# EAGLE schematic dsp_ice_rev2_release (EAGLE 7.6.0)

## Sheet 1 of 7
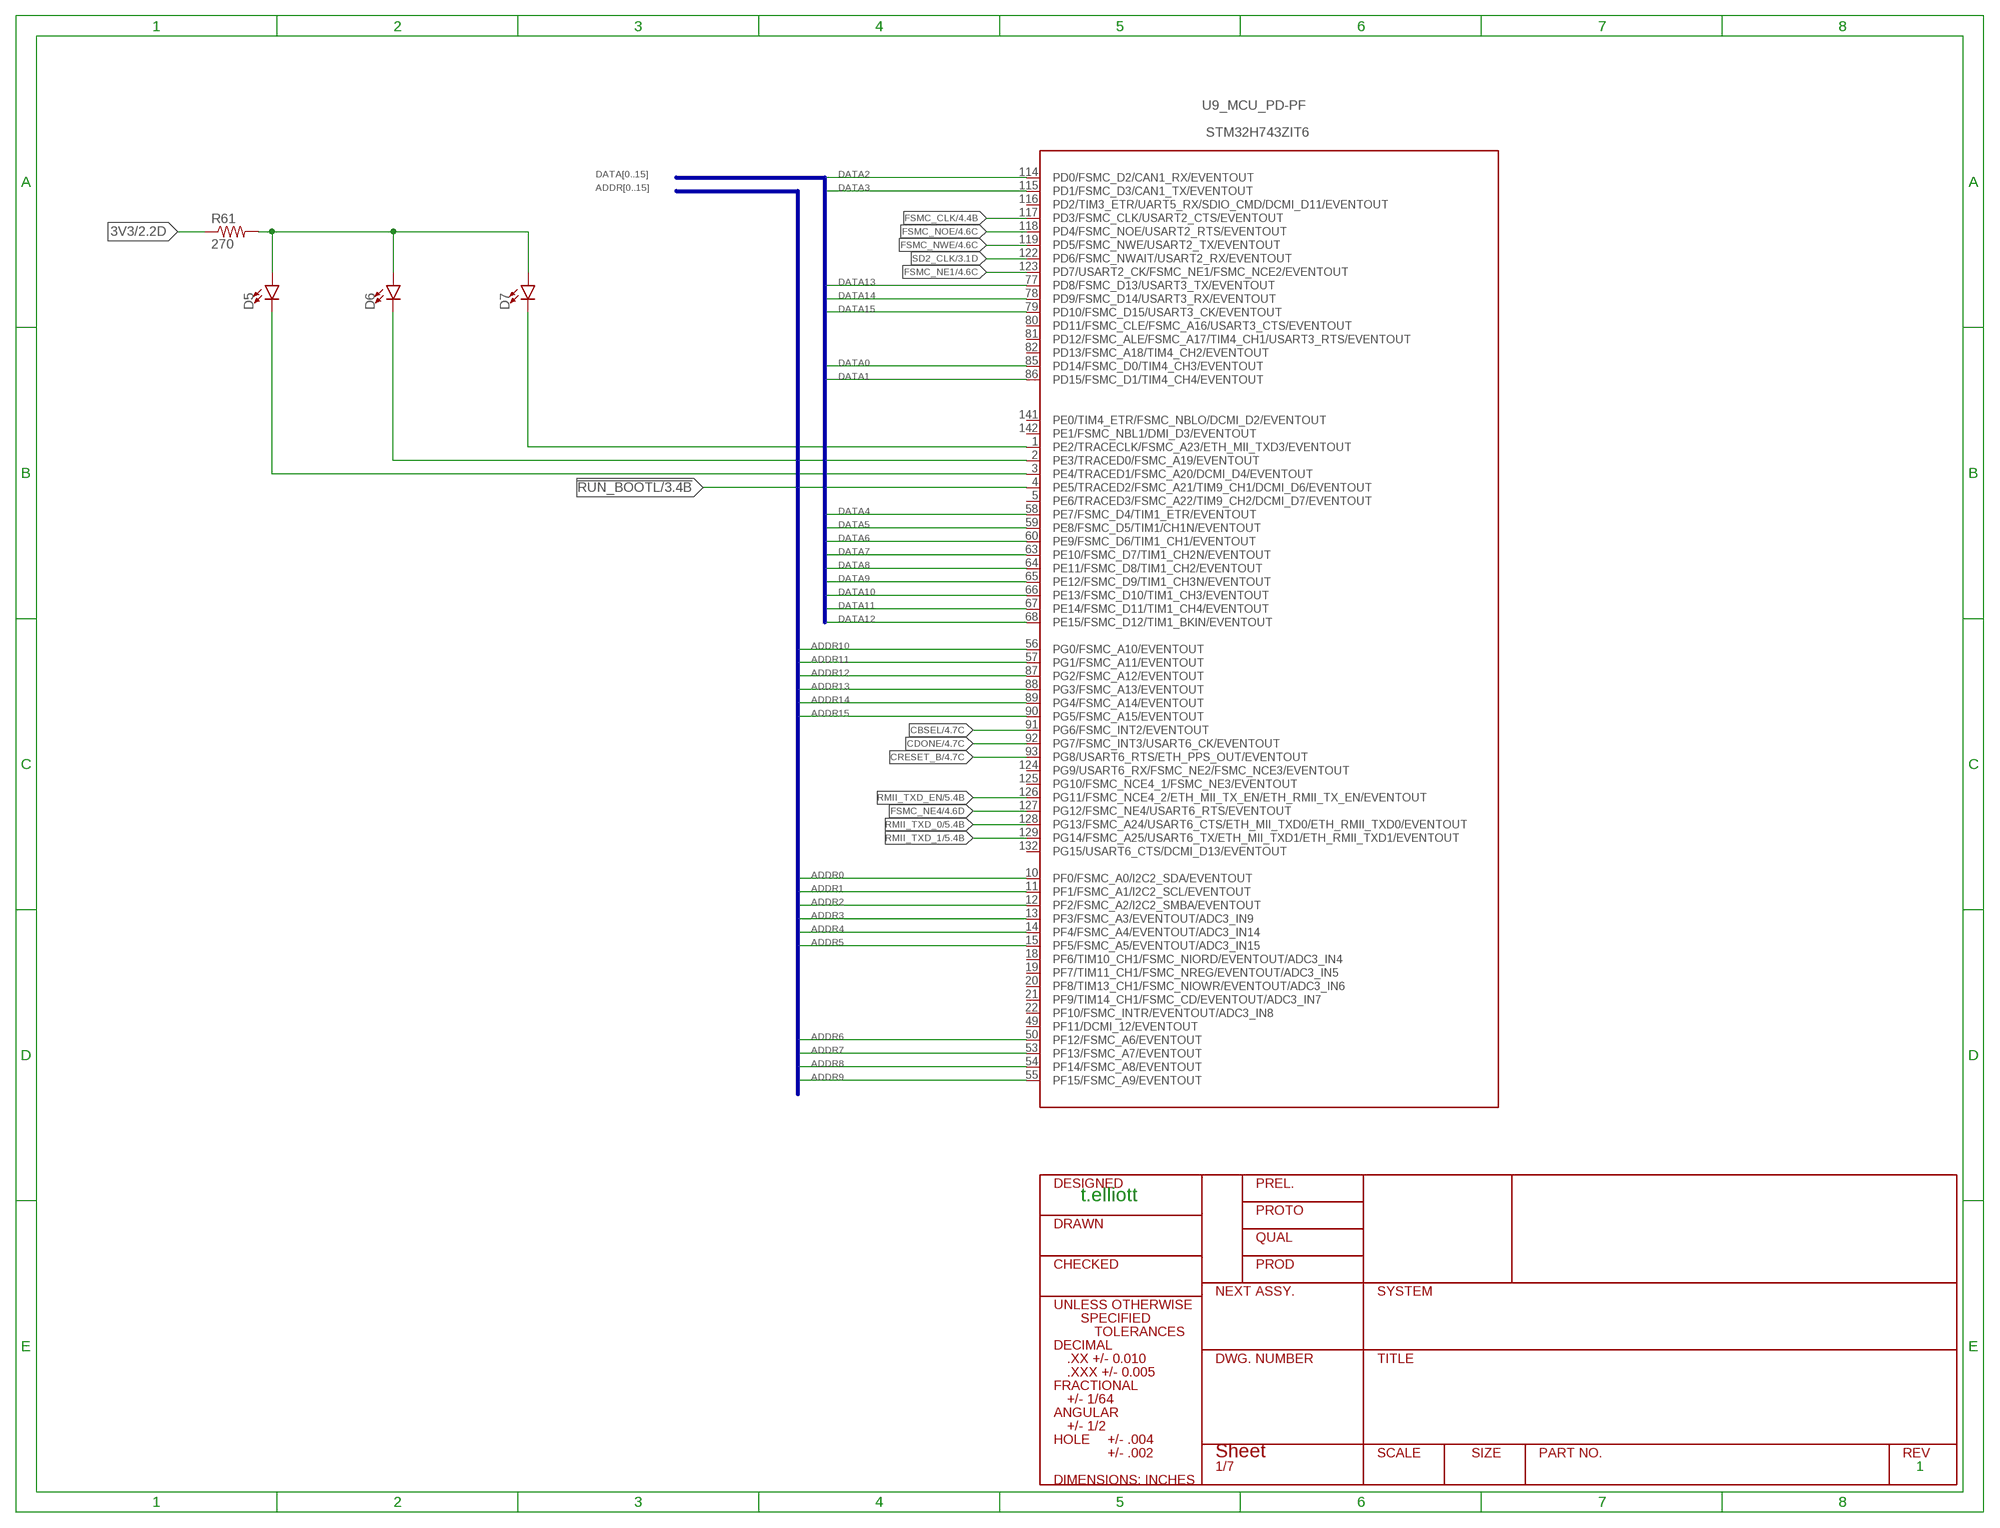
[diagram p0: schematic, sheet 1]

### Parts
D5  LED1206  [LED-1206]
D6  LED1206  [LED-1206]
D7  LED1206  [LED-1206]
R61  270  R-US_R0603  [R0603]
U9  STM32H743ZIT6  STM32F407_144_MG144  [STM32F407_144]

### Nets
3V3: R61.1 ; also sheet 2,3,4,5,6,7
!RUN_BOOTL: U9.4(_MCU_PD-PF:PE5/TRACED2/FSMC_A21/TIM9_CH1/DCMI_D6/EVENTOUT) ; also sheet 3
ADDR0: U9.10(_MCU_PD-PF:PF0/FSMC_A0/I2C2_SDA/EVENTOUT) ; also sheet 4
ADDR1: U9.11(_MCU_PD-PF:PF1/FSMC_A1/I2C2_SCL/EVENTOUT) ; also sheet 4
ADDR2: U9.12(_MCU_PD-PF:PF2/FSMC_A2/I2C2_SMBA/EVENTOUT) ; also sheet 4
ADDR3: U9.13(_MCU_PD-PF:PF3/FSMC_A3/EVENTOUT/ADC3_IN9) ; also sheet 4
ADDR4: U9.14(_MCU_PD-PF:PF4/FSMC_A4/EVENTOUT/ADC3_IN14) ; also sheet 4
ADDR5: U9.15(_MCU_PD-PF:PF5/FSMC_A5/EVENTOUT/ADC3_IN15) ; also sheet 4
ADDR6: U9.50(_MCU_PD-PF:PF12/FSMC_A6/EVENTOUT) ; also sheet 4
ADDR7: U9.53(_MCU_PD-PF:PF13/FSMC_A7/EVENTOUT) ; also sheet 4
ADDR8: U9.54(_MCU_PD-PF:PF14/FSMC_A8/EVENTOUT) ; also sheet 4
ADDR9: U9.55(_MCU_PD-PF:PF15/FSMC_A9/EVENTOUT) ; also sheet 4
ADDR10: U9.56(_MCU_PD-PF:PG0/FSMC_A10/EVENTOUT) ; also sheet 4
ADDR11: U9.57(_MCU_PD-PF:PG1/FSMC_A11/EVENTOUT) ; also sheet 4
ADDR12: U9.87(_MCU_PD-PF:PG2/FSMC_A12/EVENTOUT) ; also sheet 4
ADDR13: U9.88(_MCU_PD-PF:PG3/FSMC_A13/EVENTOUT) ; also sheet 4
ADDR14: U9.89(_MCU_PD-PF:PG4/FSMC_A14/EVENTOUT) ; also sheet 4
ADDR15: U9.90(_MCU_PD-PF:PG5/FSMC_A15/EVENTOUT) ; also sheet 4
CBSEL: U9.91(_MCU_PD-PF:PG6/FSMC_INT2/EVENTOUT) ; also sheet 4
CDONE: U9.92(_MCU_PD-PF:PG7/FSMC_INT3/USART6_CK/EVENTOUT) ; also sheet 4
CRESET_B: U9.93(_MCU_PD-PF:PG8/USART6_RTS/ETH_PPS_OUT/EVENTOUT) ; also sheet 4
DATA0: U9.85(_MCU_PD-PF:PD14/FSMC_D0/TIM4_CH3/EVENTOUT) ; also sheet 4
DATA1: U9.86(_MCU_PD-PF:PD15/FSMC_D1/TIM4_CH4/EVENTOUT) ; also sheet 4
DATA2: U9.114(_MCU_PD-PF:PD0/FSMC_D2/CAN1_RX/EVENTOUT) ; also sheet 4
DATA3: U9.115(_MCU_PD-PF:PD1/FSMC_D3/CAN1_TX/EVENTOUT) ; also sheet 4
DATA4: U9.58(_MCU_PD-PF:PE7/FSMC_D4/TIM1_ETR/EVENTOUT) ; also sheet 4
DATA5: U9.59(_MCU_PD-PF:PE8/FSMC_D5/TIM1/CH1N/EVENTOUT) ; also sheet 4
DATA6: U9.60(_MCU_PD-PF:PE9/FSMC_D6/TIM1_CH1/EVENTOUT) ; also sheet 4
DATA7: U9.63(_MCU_PD-PF:PE10/FSMC_D7/TIM1_CH2N/EVENTOUT) ; also sheet 4
DATA8: U9.64(_MCU_PD-PF:PE11/FSMC_D8/TIM1_CH2/EVENTOUT) ; also sheet 4
DATA9: U9.65(_MCU_PD-PF:PE12/FSMC_D9/TIM1_CH3N/EVENTOUT) ; also sheet 4
DATA10: U9.66(_MCU_PD-PF:PE13/FSMC_D10/TIM1_CH3/EVENTOUT) ; also sheet 4
DATA11: U9.67(_MCU_PD-PF:PE14/FSMC_D11/TIM1_CH4/EVENTOUT) ; also sheet 4
DATA12: U9.68(_MCU_PD-PF:PE15/FSMC_D12/TIM1_BKIN/EVENTOUT) ; also sheet 4
DATA13: U9.77(_MCU_PD-PF:PD8/FSMC_D13/USART3_TX/EVENTOUT) ; also sheet 4
DATA14: U9.78(_MCU_PD-PF:PD9/FSMC_D14/USART3_RX/EVENTOUT) ; also sheet 4
DATA15: U9.79(_MCU_PD-PF:PD10/FSMC_D15/USART3_CK/EVENTOUT) ; also sheet 4
FSMC_CLK: U9.117(_MCU_PD-PF:PD3/FSMC_CLK/USART2_CTS/EVENTOUT) ; also sheet 4
FSMC_NE1: U9.123(_MCU_PD-PF:PD7/USART2_CK/FSMC_NE1/FSMC_NCE2/EVENTOUT) ; also sheet 4
FSMC_NE4: U9.127(_MCU_PD-PF:PG12/FSMC_NE4/USART6_RTS/EVENTOUT) ; also sheet 4
FSMC_NOE: U9.118(_MCU_PD-PF:PD4/FSMC_NOE/USART2_RTS/EVENTOUT) ; also sheet 4
FSMC_NWE: U9.119(_MCU_PD-PF:PD5/FSMC_NWE/USART2_TX/EVENTOUT) ; also sheet 4
N$33: D5.A D6.A D7.A R61.2
N$37: D7.C U9.1(_MCU_PD-PF:PE2/TRACECLK/FSMC_A23/ETH_MII_TXD3/EVENTOUT)
N$38: D6.C U9.2(_MCU_PD-PF:PE3/TRACED0/FSMC_A19/EVENTOUT)
N$43: D5.C U9.3(_MCU_PD-PF:PE4/TRACED1/FSMC_A20/DCMI_D4/EVENTOUT)
RMII_TXD_0: U9.128(_MCU_PD-PF:PG13/FSMC_A24/USART6_CTS/ETH_MII_TXD0/ETH_RMII_TXD0/EVENTOUT) ; also sheet 5
RMII_TXD_1: U9.129(_MCU_PD-PF:PG14/FSMC_A25/USART6_TX/ETH_MII_TXD1/ETH_RMII_TXD1/EVENTOUT) ; also sheet 5
RMII_TXD_EN: U9.126(_MCU_PD-PF:PG11/FSMC_NCE4_2/ETH_MII_TX_EN/ETH_RMII_TX_EN/EVENTOUT) ; also sheet 5
SD2_CLK: U9.122(_MCU_PD-PF:PD6/FSMC_NWAIT/USART2_RX/EVENTOUT) ; also sheet 3
Unconnected: U9.5(_MCU_PD-PF:PE6/TRACED3/FSMC_A22/TIM9_CH2/DCMI_D7/EVENTOUT) U9.18(_MCU_PD-PF:PF6/TIM10_CH1/FSMC_NIORD/EVENTOUT/ADC3_IN4) U9.19(_MCU_PD-PF:PF7/TIM11_CH1/FSMC_NREG/EVENTOUT/ADC3_IN5) U9.20(_MCU_PD-PF:PF8/TIM13_CH1/FSMC_NIOWR/EVENTOUT/ADC3_IN6) U9.21(_MCU_PD-PF:PF9/TIM14_CH1/FSMC_CD/EVENTOUT/ADC3_IN7) U9.22(_MCU_PD-PF:PF10/FSMC_INTR/EVENTOUT/ADC3_IN8) U9.49(_MCU_PD-PF:PF11/DCMI_12/EVENTOUT) U9.80(_MCU_PD-PF:PD11/FSMC_CLE/FSMC_A16/USART3_CTS/EVENTOUT) U9.81(_MCU_PD-PF:PD12/FSMC_ALE/FSMC_A17/TIM4_CH1/USART3_RTS/EVENTOUT) U9.82(_MCU_PD-PF:PD13/FSMC_A18/TIM4_CH2/EVENTOUT) U9.116(_MCU_PD-PF:PD2/TIM3_ETR/UART5_RX/SDIO_CMD/DCMI_D11/EVENTOUT) U9.124(_MCU_PD-PF:PG9/USART6_RX/FSMC_NE2/FSMC_NCE3/EVENTOUT) U9.125(_MCU_PD-PF:PG10/FSMC_NCE4_1/FSMC_NE3/EVENTOUT) U9.132(_MCU_PD-PF:PG15/USART6_CTS/DCMI_D13/EVENTOUT) U9.141(_MCU_PD-PF:PE0/TIM4_ETR/FSMC_NBLO/DCMI_D2/EVENTOUT) U9.142(_MCU_PD-PF:PE1/FSMC_NBL1/DMI_D3/EVENTOUT)

### Buses
DATA[0..15]
ADDR[0..15]

### Notes on the sheet
- t.elliott
- 1

## Sheet 2 of 7
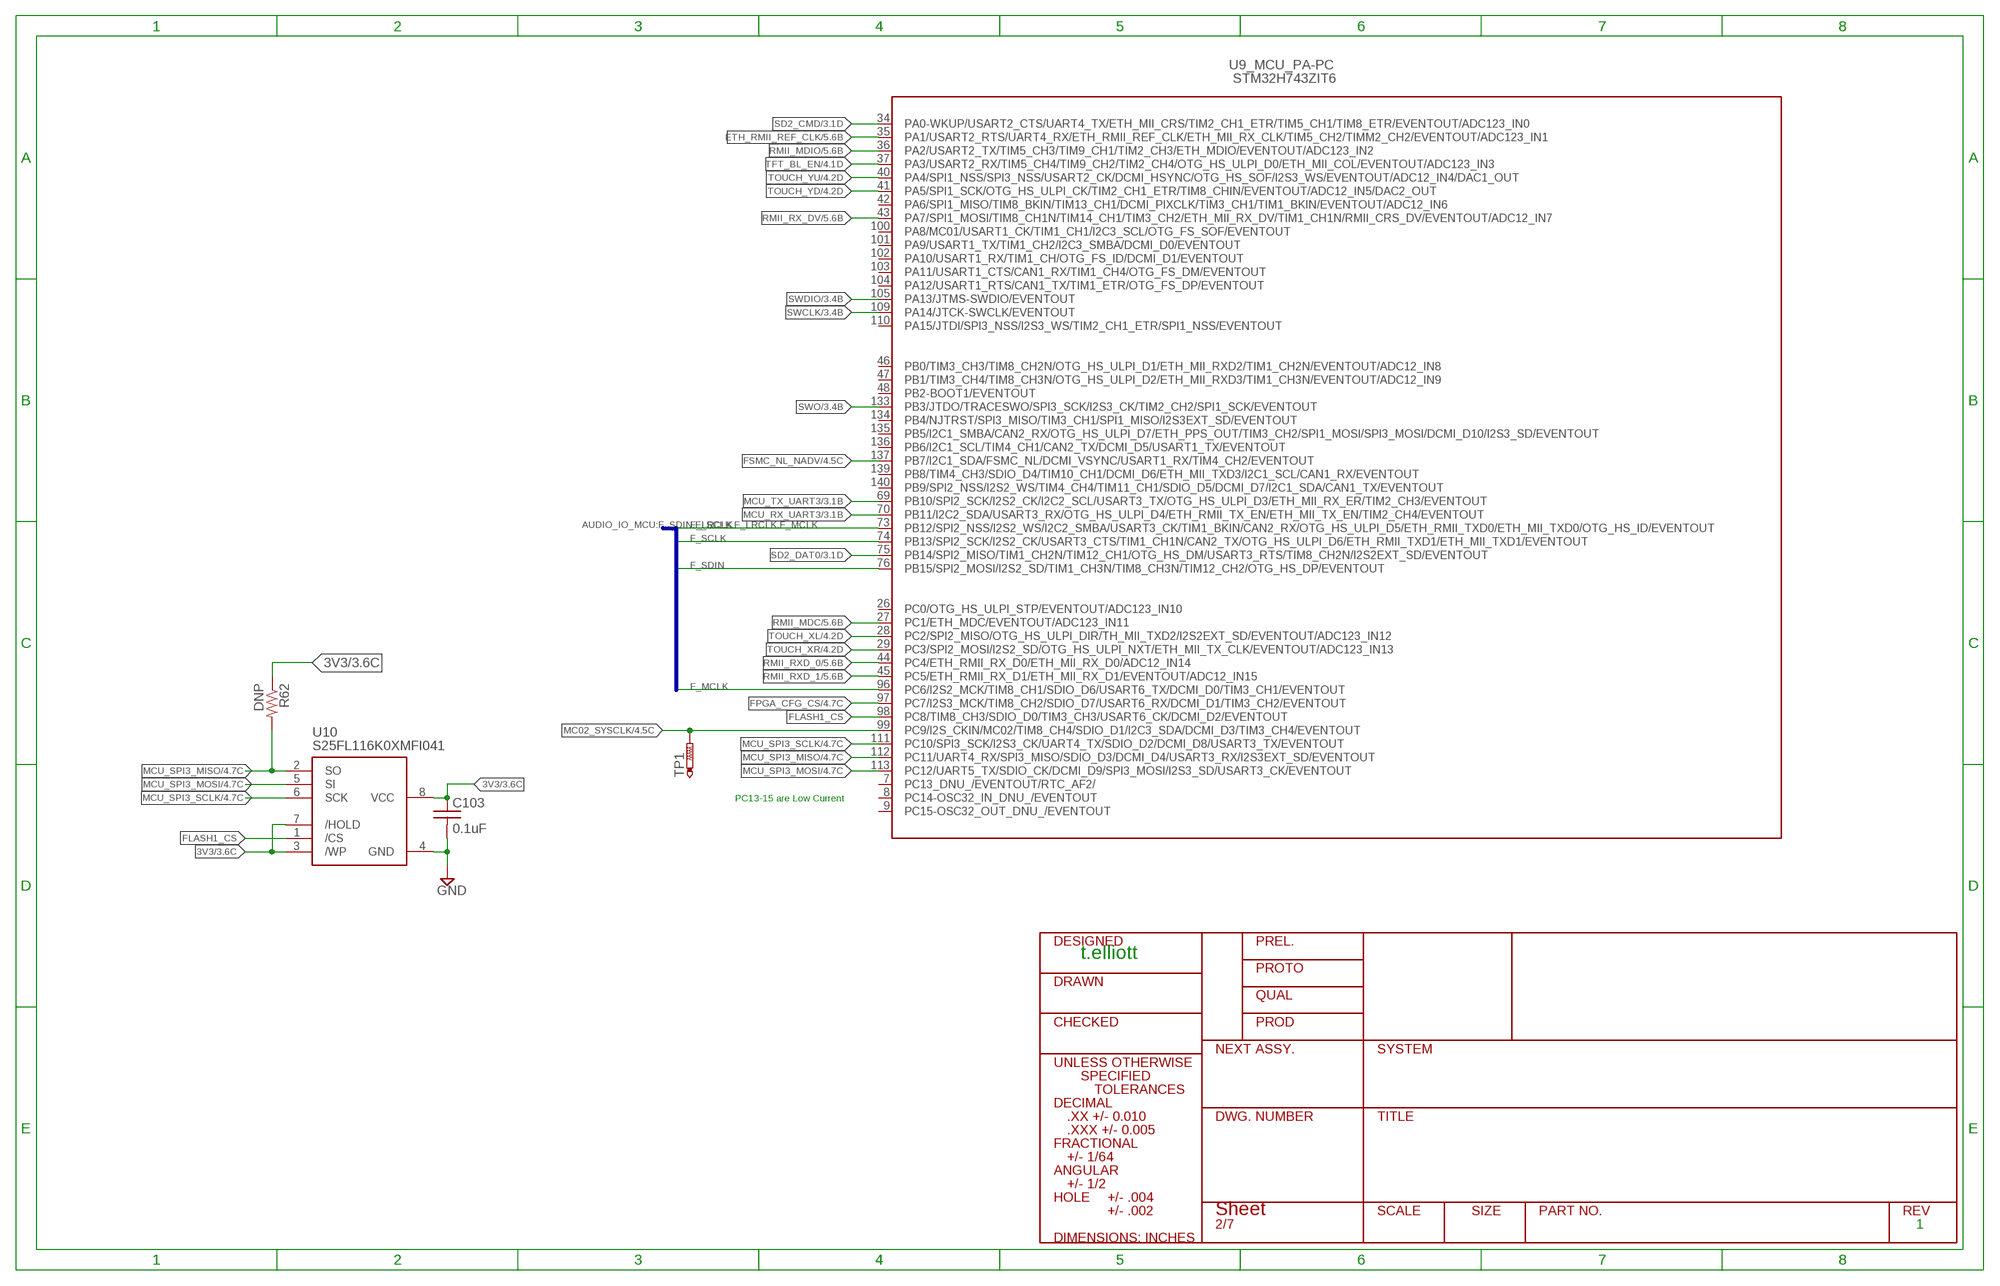
[diagram p1: schematic, sheet 2]

### Parts
C103  0.1uF  C-USC0603  [C0603]
R62  DNP  R-US_R0603  [R0603]
TP1  PTR1TP08R  [TP08R]
U10  S25FL116K0XMFI041  AT25F512ASOIC  [SO8]

### Nets
3V3: C103.1 R62.1 U10.3(/WP) U10.7(/HOLD) U10.8(VCC) ; also sheet 1,3,4,5,6,7
ETH_RMII_REF_CLK: U9.35(_MCU_PA-PC:PA1/USART2_RTS/UART4_RX/ETH_RMII_REF_CLK/ETH_MII_RX_CLK/TIM5_CH2/TIMM2_CH2/EVENTOUT/ADC123_IN1) ; also sheet 5
F_LRCLK: U9.73(_MCU_PA-PC:PB12/SPI2_NSS/I2S2_WS/I2C2_SMBA/USART3_CK/TIM1_BKIN/CAN2_RX/OTG_HS_ULPI_D5/ETH_RMII_TXD0/ETH_MII_TXD0/OTG_HS_ID/EVENTOUT) ; also sheet 4
F_MCLK: U9.96(_MCU_PA-PC:PC6/I2S2_MCK/TIM8_CH1/SDIO_D6/USART6_TX/DCMI_D0/TIM3_CH1/EVENTOUT) ; also sheet 4
F_SCLK: U9.74(_MCU_PA-PC:PB13/SPI2_SCK/I2S2_CK/USART3_CTS/TIM1_CH1N/CAN2_TX/OTG_HS_ULPI_D6/ETH_RMII_TXD1/ETH_MII_TXD1/EVENTOUT) ; also sheet 4
F_SDIN: U9.76(_MCU_PA-PC:PB15/SPI2_MOSI/I2S2_SD/TIM1_CH3N/TIM8_CH3N/TIM12_CH2/OTG_HS_DP/EVENTOUT) ; also sheet 4
FLASH1_CS: U9.98(_MCU_PA-PC:PC8/TIM8_CH3/SDIO_D0/TIM3_CH3/USART6_CK/DCMI_D2/EVENTOUT) U10.1(/CS)
FPGA_CFG_CS: U9.97(_MCU_PA-PC:PC7/I2S3_MCK/TIM8_CH2/SDIO_D7/USART6_RX/DCMI_D1/TIM3_CH2/EVENTOUT) ; also sheet 4
FSMC_NL_NADV: U9.137(_MCU_PA-PC:PB7/I2C1_SDA/FSMC_NL/DCMI_VSYNC/USART1_RX/TIM4_CH2/EVENTOUT) ; also sheet 4
GND: C103.2 U10.4(GND) ; also sheet 3,4,5,6,7
MC02_SYSCLK: TP1.TP U9.99(_MCU_PA-PC:PC9/I2S_CKIN/MC02/TIM8_CH4/SDIO_D1/I2C3_SDA/DCMI_D3/TIM3_CH4/EVENTOUT) ; also sheet 4
MCU_RX_UART3: U9.70(_MCU_PA-PC:PB11/I2C2_SDA/USART3_RX/OTG_HS_ULPI_D4/ETH_RMII_TX_EN/ETH_MII_TX_EN/TIM2_CH4/EVENTOUT) ; also sheet 3
MCU_SPI3_MISO: R62.2 U9.112(_MCU_PA-PC:PC11/UART4_RX/SPI3_MISO/SDIO_D3/DCMI_D4/USART3_RX/I2S3EXT_SD/EVENTOUT) U10.2(SO) ; also sheet 4
MCU_SPI3_MOSI: U9.113(_MCU_PA-PC:PC12/UART5_TX/SDIO_CK/DCMI_D9/SPI3_MOSI/I2S3_SD/USART3_CK/EVENTOUT) U10.5(SI) ; also sheet 4
MCU_SPI3_SCLK: U9.111(_MCU_PA-PC:PC10/SPI3_SCK/I2S3_CK/UART4_TX/SDIO_D2/DCMI_D8/USART3_TX/EVENTOUT) U10.6(SCK) ; also sheet 4
MCU_TX_UART3: U9.69(_MCU_PA-PC:PB10/SPI2_SCK/I2S2_CK/I2C2_SCL/USART3_TX/OTG_HS_ULPI_D3/ETH_MII_RX_ER/TIM2_CH3/EVENTOUT) ; also sheet 3
RMII_MDC: U9.27(_MCU_PA-PC:PC1/ETH_MDC/EVENTOUT/ADC123_IN11) ; also sheet 5
RMII_MDIO: U9.36(_MCU_PA-PC:PA2/USART2_TX/TIM5_CH3/TIM9_CH1/TIM2_CH3/ETH_MDIO/EVENTOUT/ADC123_IN2) ; also sheet 5
RMII_RX_DV: U9.43(_MCU_PA-PC:PA7/SPI1_MOSI/TIM8_CH1N/TIM14_CH1/TIM3_CH2/ETH_MII_RX_DV/TIM1_CH1N/RMII_CRS_DV/EVENTOUT/ADC12_IN7) ; also sheet 5
RMII_RXD_0: U9.44(_MCU_PA-PC:PC4/ETH_RMII_RX_D0/ETH_MII_RX_D0/ADC12_IN14) ; also sheet 5
RMII_RXD_1: U9.45(_MCU_PA-PC:PC5/ETH_RMII_RX_D1/ETH_MII_RX_D1/EVENTOUT/ADC12_IN15) ; also sheet 5
SD2_CMD: U9.34(_MCU_PA-PC:PA0-WKUP/USART2_CTS/UART4_TX/ETH_MII_CRS/TIM2_CH1_ETR/TIM5_CH1/TIM8_ETR/EVENTOUT/ADC123_IN0) ; also sheet 3
SD2_DAT0: U9.75(_MCU_PA-PC:PB14/SPI2_MISO/TIM1_CH2N/TIM12_CH1/OTG_HS_DM/USART3_RTS/TIM8_CH2N/I2S2EXT_SD/EVENTOUT) ; also sheet 3
SWCLK: U9.109(_MCU_PA-PC:PA14/JTCK-SWCLK/EVENTOUT) ; also sheet 3
SWDIO: U9.105(_MCU_PA-PC:PA13/JTMS-SWDIO/EVENTOUT) ; also sheet 3
SWO: U9.133(_MCU_PA-PC:PB3/JTDO/TRACESWO/SPI3_SCK/I2S3_CK/TIM2_CH2/SPI1_SCK/EVENTOUT) ; also sheet 3
TFT_BL_EN: U9.37(_MCU_PA-PC:PA3/USART2_RX/TIM5_CH4/TIM9_CH2/TIM2_CH4/OTG_HS_ULPI_D0/ETH_MII_COL/EVENTOUT/ADC123_IN3) ; also sheet 4
TOUCH_XL: U9.28(_MCU_PA-PC:PC2/SPI2_MISO/OTG_HS_ULPI_DIR/TH_MII_TXD2/I2S2EXT_SD/EVENTOUT/ADC123_IN12) ; also sheet 4
TOUCH_XR: U9.29(_MCU_PA-PC:PC3/SPI2_MOSI/I2S2_SD/OTG_HS_ULPI_NXT/ETH_MII_TX_CLK/EVENTOUT/ADC123_IN13) ; also sheet 4
TOUCH_YD: U9.41(_MCU_PA-PC:PA5/SPI1_SCK/OTG_HS_ULPI_CK/TIM2_CH1_ETR/TIM8_CHIN/EVENTOUT/ADC12_IN5/DAC2_OUT) ; also sheet 4
TOUCH_YU: U9.40(_MCU_PA-PC:PA4/SPI1_NSS/SPI3_NSS/USART2_CK/DCMI_HSYNC/OTG_HS_SOF/I2S3_WS/EVENTOUT/ADC12_IN4/DAC1_OUT) ; also sheet 4
Unconnected: U9.7(_MCU_PA-PC:PC13_DNU_/EVENTOUT/RTC_AF2/) U9.8(_MCU_PA-PC:PC14-OSC32_IN_DNU_/EVENTOUT) U9.9(_MCU_PA-PC:PC15-OSC32_OUT_DNU_/EVENTOUT) U9.26(_MCU_PA-PC:PC0/OTG_HS_ULPI_STP/EVENTOUT/ADC123_IN10) U9.42(_MCU_PA-PC:PA6/SPI1_MISO/TIM8_BKIN/TIM13_CH1/DCMI_PIXCLK/TIM3_CH1/TIM1_BKIN/EVENTOUT/ADC12_IN6) U9.46(_MCU_PA-PC:PB0/TIM3_CH3/TIM8_CH2N/OTG_HS_ULPI_D1/ETH_MII_RXD2/TIM1_CH2N/EVENTOUT/ADC12_IN8) U9.47(_MCU_PA-PC:PB1/TIM3_CH4/TIM8_CH3N/OTG_HS_ULPI_D2/ETH_MII_RXD3/TIM1_CH3N/EVENTOUT/ADC12_IN9) U9.48(_MCU_PA-PC:PB2-BOOT1/EVENTOUT) U9.100(_MCU_PA-PC:PA8/MC01/USART1_CK/TIM1_CH1/I2C3_SCL/OTG_FS_SOF/EVENTOUT) U9.101(_MCU_PA-PC:PA9/USART1_TX/TIM1_CH2/I2C3_SMBA/DCMI_D0/EVENTOUT) U9.102(_MCU_PA-PC:PA10/USART1_RX/TIM1_CH/OTG_FS_ID/DCMI_D1/EVENTOUT) U9.103(_MCU_PA-PC:PA11/USART1_CTS/CAN1_RX/TIM1_CH4/OTG_FS_DM/EVENTOUT) U9.104(_MCU_PA-PC:PA12/USART1_RTS/CAN1_TX/TIM1_ETR/OTG_FS_DP/EVENTOUT) U9.110(_MCU_PA-PC:PA15/JTDI/SPI3_NSS/I2S3_WS/TIM2_CH1_ETR/SPI1_NSS/EVENTOUT) U9.134(_MCU_PA-PC:PB4/NJTRST/SPI3_MISO/TIM3_CH1/SPI1_MISO/I2S3EXT_SD/EVENTOUT) U9.135(_MCU_PA-PC:PB5/I2C1_SMBA/CAN2_RX/OTG_HS_ULPI_D7/ETH_PPS_OUT/TIM3_CH2/SPI1_MOSI/SPI3_MOSI/DCMI_D10/I2S3_SD/EVENTOUT) U9.136(_MCU_PA-PC:PB6/I2C1_SCL/TIM4_CH1/CAN2_TX/DCMI_D5/USART1_TX/EVENTOUT) U9.139(_MCU_PA-PC:PB8/TIM4_CH3/SDIO_D4/TIM10_CH1/DCMI_D6/ETH_MII_TXD3/I2C1_SCL/CAN1_RX/EVENTOUT) U9.140(_MCU_PA-PC:PB9/SPI2_NSS/I2S2_WS/TIM4_CH4/TIM11_CH1/SDIO_D5/DCMI_D7/I2C1_SDA/CAN1_TX/EVENTOUT)

### Buses
AUDIO_IO_MCU:F_SDIN,F_SCLK,F_LRCLK,F_MCLK

### Notes on the sheet
- PC13-15 are Low Current
- t.elliott
- 1

## Sheet 3 of 7
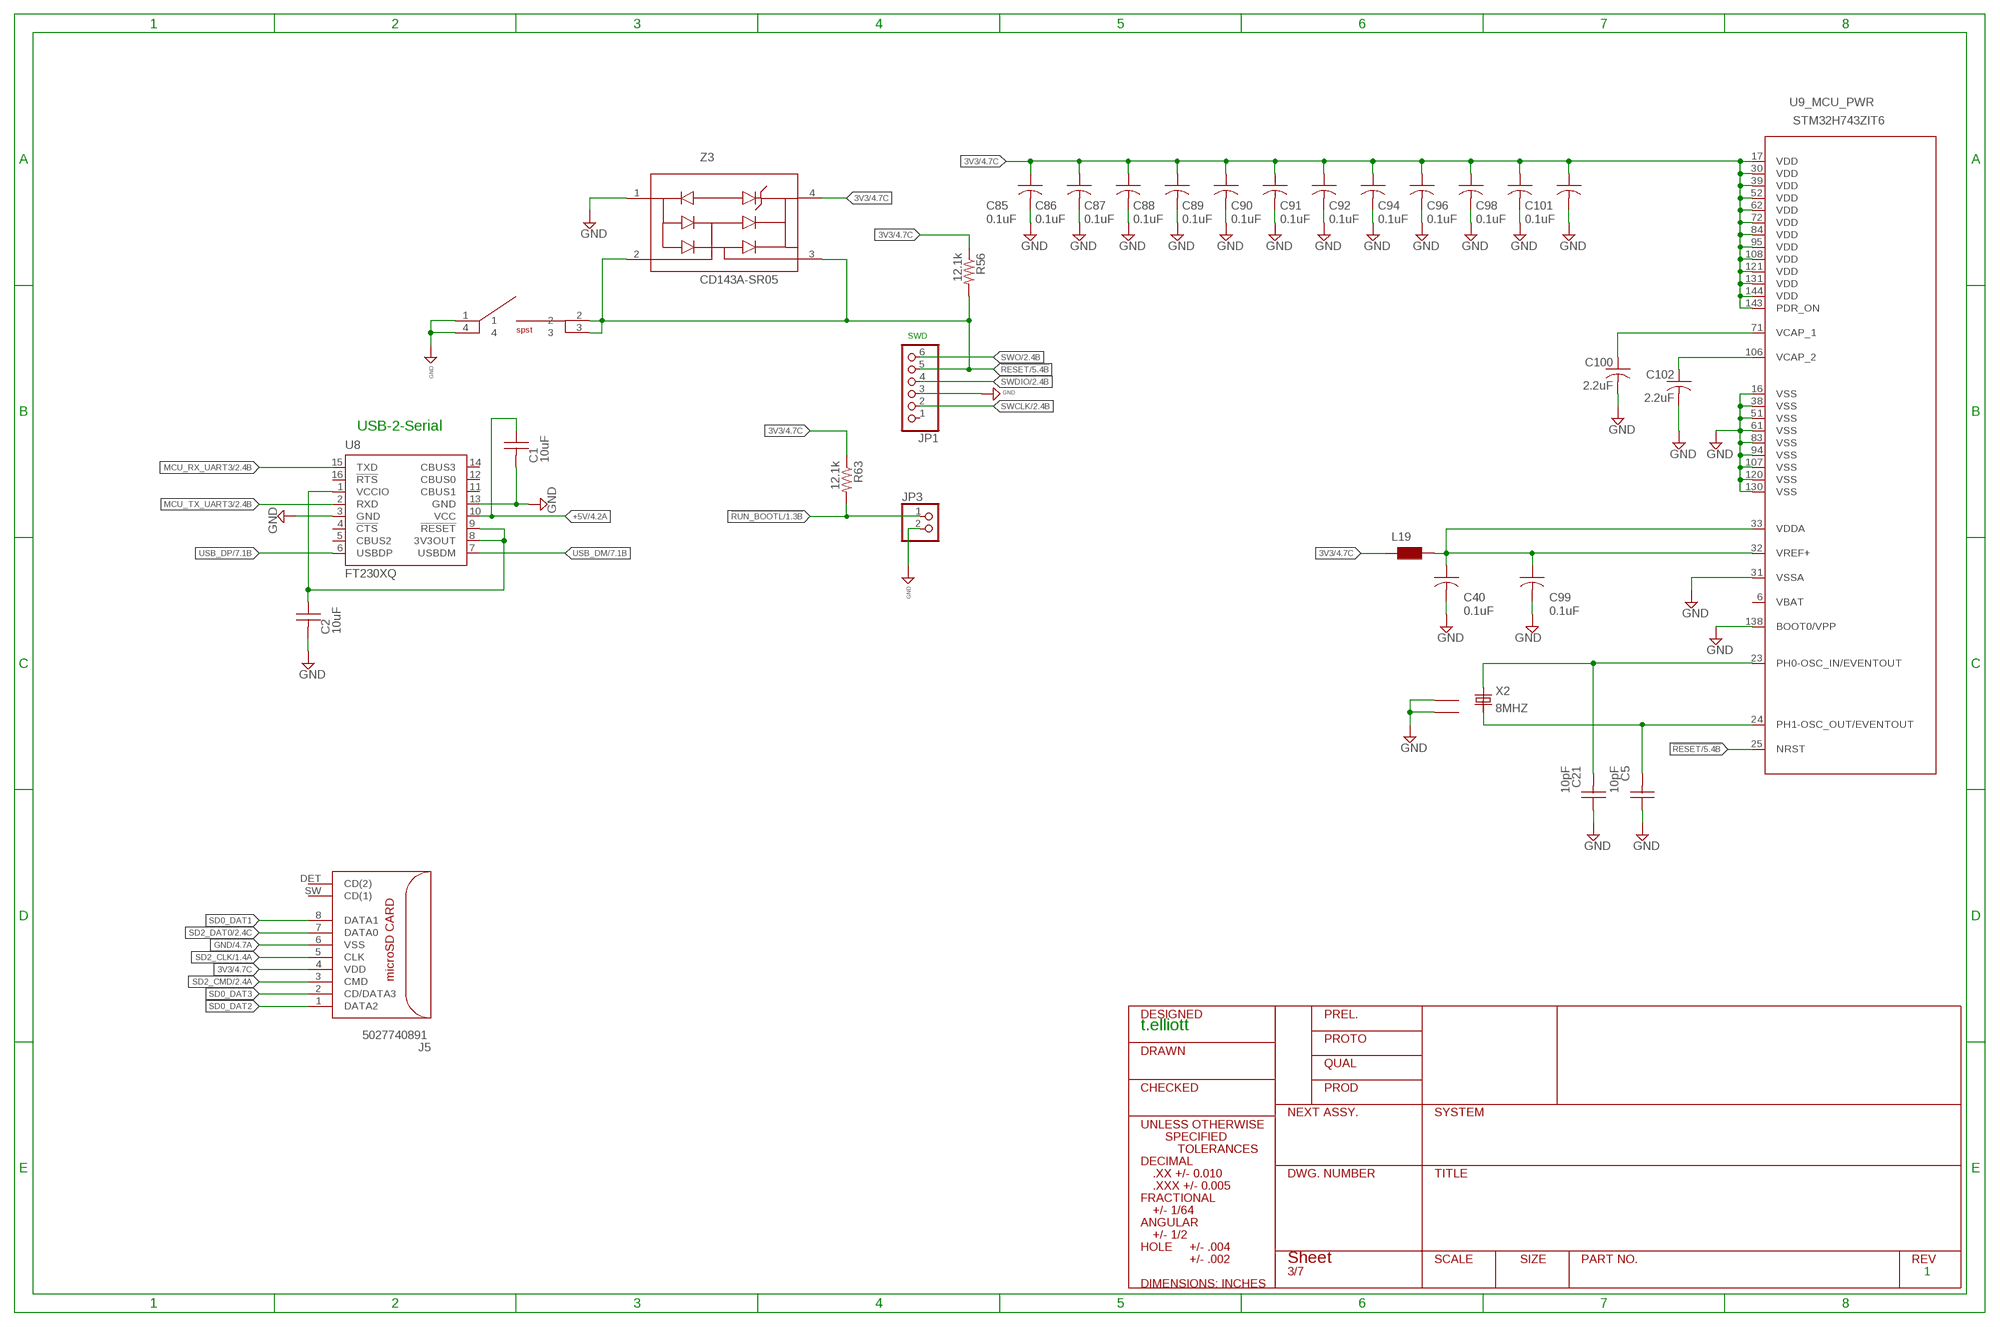
[diagram p2: schematic, sheet 3]

### Parts
C1  10uF  C-USC0805  [C0805]
C2  10uF  C-USC0805  [C0805]
C5  10pF  C-USC0402  [C0402]
C21  10pF  C-USC0402  [C0402]
C40  0.1uF  CAPACITOR0402  [0402]
C85  0.1uF  CAPACITOR0402  [0402]
C86  0.1uF  CAPACITOR0402  [0402]
C87  0.1uF  CAPACITOR0402  [0402]
C88  0.1uF  CAPACITOR0402  [0402]
C89  0.1uF  CAPACITOR0402  [0402]
C90  0.1uF  CAPACITOR0402  [0402]
C91  0.1uF  CAPACITOR0402  [0402]
C92  0.1uF  CAPACITOR0402  [0402]
C94  0.1uF  CAPACITOR0402  [0402]
C96  0.1uF  CAPACITOR0402  [0402]
C98  0.1uF  CAPACITOR0402  [0402]
C99  0.1uF  CAPACITOR0402  [0402]
C100  2.2uF  C-USC0805  [C0805]
C101  0.1uF  CAPACITOR0402  [0402]
C102  2.2uF  C-USC0805  [C0805]
J5  5027740891  SD-502774-001  [SD-502774-001]
JP1  PINHD-1X6  [1X06]
JP3  PINHD-1X2  [1X02]
L19  WE-CBF_0603  [0603]
R56  12.1k  R-US_R0603  [R0603]
R63  12.1k  R-US_R0603  [R0603]
SW3  HOKURIKU_KSM06_6X6MM_SWITCH1  [TACTILE_6X6MM]
U8  FT230XQ  [QFN16]
X2  8MHZ  ECS-250-20-30B-DUDU  [ECS-250-20-30B-DU_CRYSTAL]
Z3  CD143A-SR05  SR2.8_TVS  [SR2.8.TCT_1PRIMARY]

### Nets
3V3: C85.1(A) C86.1(A) C87.1(A) C88.1(A) C89.1(A) C90.1(A) C91.1(A) C92.1(A) C94.1(A) C96.1(A) C98.1(A) C101.1(A) J5.4(VDD) L19.1 R56.1 R63.1 U9.17(_MCU_PWR:VDD) U9.30(_MCU_PWR:VDD) U9.39(_MCU_PWR:VDD) U9.52(_MCU_PWR:VDD) U9.62(_MCU_PWR:VDD) U9.72(_MCU_PWR:VDD) U9.84(_MCU_PWR:VDD) U9.95(_MCU_PWR:VDD) U9.108(_MCU_PWR:VDD) U9.121(_MCU_PWR:VDD) U9.131(_MCU_PWR:VDD) U9.143(_MCU_PWR:PDR_ON) U9.144(_MCU_PWR:VDD) Z3.4(REF) ; also sheet 1,2,4,5,6,7
3V_ANALOG: C40.1(A) C99.1(A) L19.2 U9.32(_MCU_PWR:VREF+) U9.33(_MCU_PWR:VDDA)
20MHZ_REF: C21.2 U9.23(_MCU_PWR:PH0-OSC_IN/EVENTOUT) X2.1
!RESET: JP1.5 R56.2 SW3.2 SW3.3 U9.25(_MCU_PWR:NRST) Z3.2(I/O) Z3.3(I/O) ; also sheet 5
!RUN_BOOTL: JP3.1 R63.2 ; also sheet 1
+5V: C1.1 U8.10(VCC) ; also sheet 4,7
GND: C1.2 C2.2 C5.1 C21.1 C40.2(C) C85.2(C) C86.2(C) C87.2(C) C88.2(C) C89.2(C) C90.2(C) C91.2(C) C92.2(C) C94.2(C) C96.2(C) C98.2(C) C99.2(C) C100.2 C101.2(C) C102.2 J5.6(VSS) JP1.3 JP3.2 SW3.1 SW3.4 U8.3(GND) U8.13(GND) U9.16(_MCU_PWR:VSS) U9.31(_MCU_PWR:VSSA) U9.38(_MCU_PWR:VSS) U9.51(_MCU_PWR:VSS) U9.61(_MCU_PWR:VSS) U9.83(_MCU_PWR:VSS) U9.94(_MCU_PWR:VSS) U9.107(_MCU_PWR:VSS) U9.120(_MCU_PWR:VSS) U9.130(_MCU_PWR:VSS) U9.138(_MCU_PWR:BOOT0/VPP) X2.GND@1 X2.GND@2 Z3.1(GND) ; also sheet 2,4,5,6,7
MCU_RX_UART3: U8.15(TXD) ; also sheet 2
MCU_TX_UART3: U8.2(RXD) ; also sheet 2
N$30: C102.1 U9.106(_MCU_PWR:VCAP_2)
N$34: C2.1 U8.1(VCCIO) U8.8(3V3OUT) U8.9(!RESET)
N$35: C100.1 U9.71(_MCU_PWR:VCAP_1)
SD0_DAT1: J5.8(DATA1)
SD0_DAT2: J5.1(DATA2)
SD0_DAT3: J5.2(CD/DATA3)
SD2_CLK: J5.5(CLK) ; also sheet 1
SD2_CMD: J5.3(CMD) ; also sheet 2
SD2_DAT0: J5.7(DATA0) ; also sheet 2
SWCLK: JP1.2 ; also sheet 2
SWDIO: JP1.4 ; also sheet 2
SWO: JP1.6 ; also sheet 2
USB_DM: U8.7(USBDM) ; also sheet 7
USB_DP: U8.6(USBDP) ; also sheet 7
X2: C5.2 U9.24(_MCU_PWR:PH1-OSC_OUT/EVENTOUT) X2.3
Unconnected: J5.DET(CD(2)) J5.SW(CD(1)) JP1.1 U8.4(!CTS) U8.5(CBUS2) U8.11(CBUS1) U8.12(CBUS0) U8.14(CBUS3) U8.16(!RTS) U9.6(_MCU_PWR:VBAT)

### Notes on the sheet
- SWD
- USB-2-Serial
- t.elliott
- 1

## Sheet 4 of 7
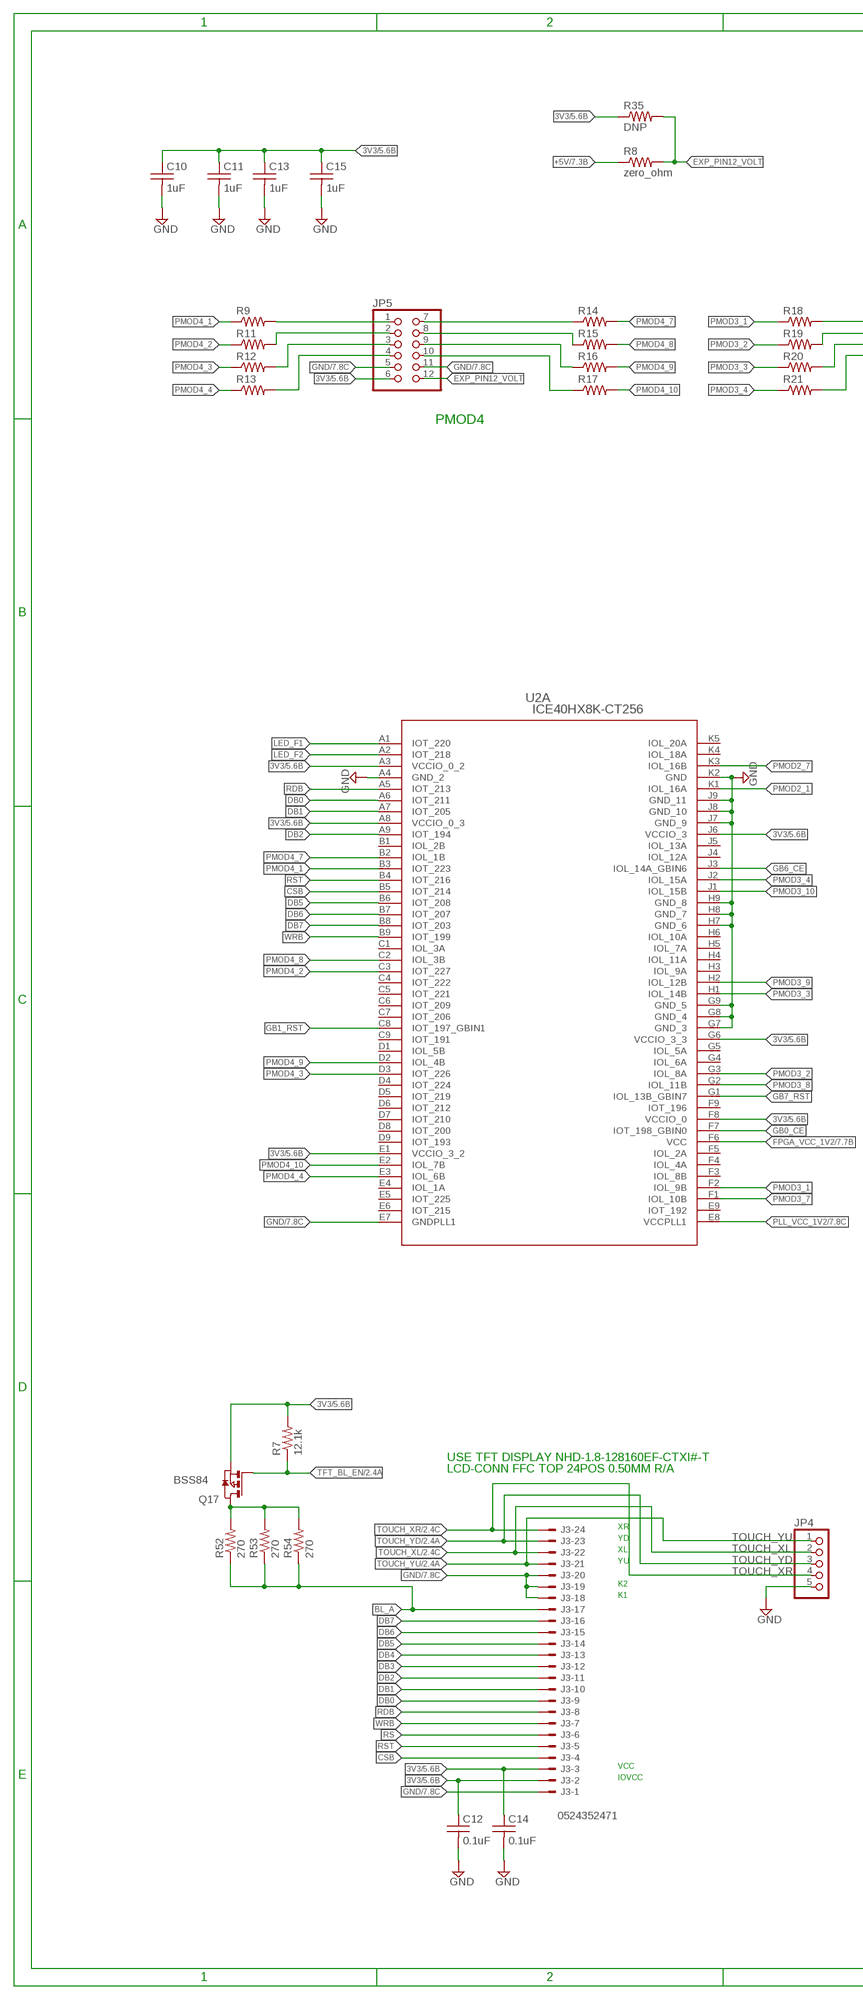
[diagram p3: schematic, sheet 4, part 1 of 2]
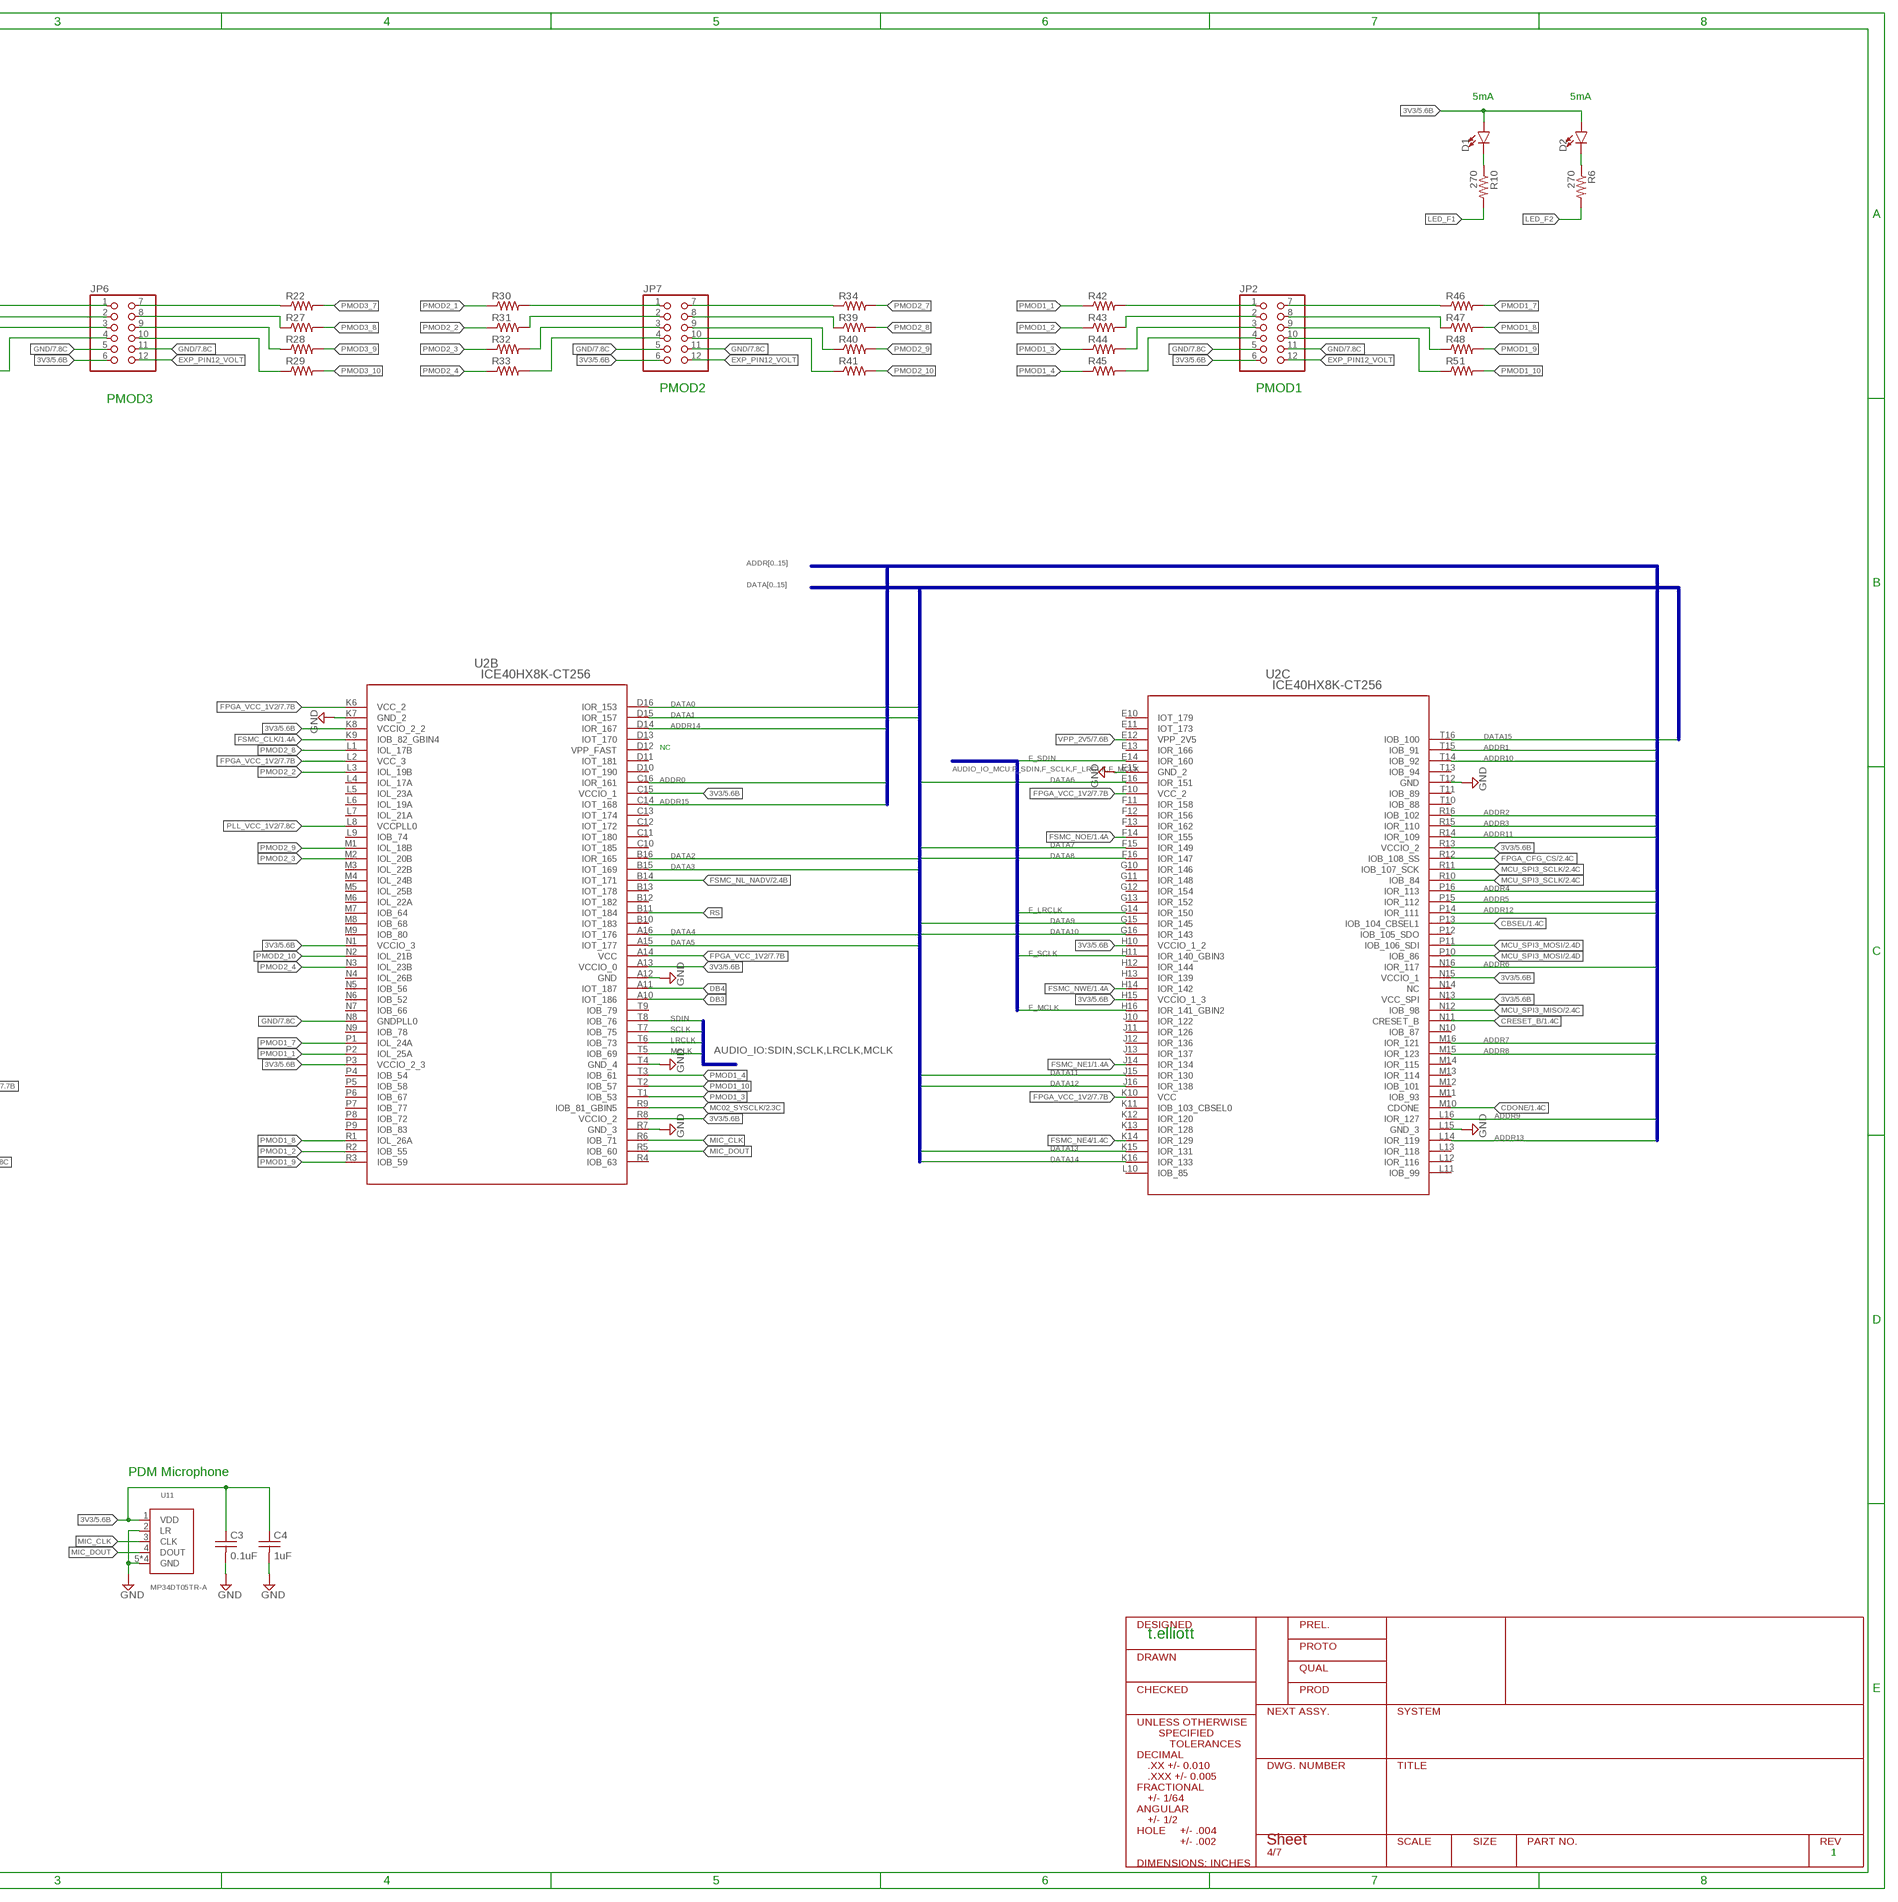
[diagram p4: schematic, sheet 4, part 2 of 2]

### Parts
C3  0.1uF  C-USC0603  [C0603]
C4  1uF  C-USC0603  [C0603]
C10  1uF  C-USC0603  [C0603]
C11  1uF  C-USC0603  [C0603]
C12  0.1uF  C-USC0603  [C0603]
C13  1uF  C-USC0603  [C0603]
C14  0.1uF  C-USC0603  [C0603]
C15  1uF  C-USC0603  [C0603]
D1  LED1206  [LED-1206]
D2  LED1206  [LED-1206]
J3  0524352471  52745-2490  [52745-2490]
JP2  PINHD-2X6  [2X06]
JP4  PINHD-1X5  [1X05]
JP5  PINHD-2X6  [2X06]
JP6  PINHD-2X6  [2X06]
JP7  PINHD-2X6  [2X06]
Q17  BSS84  [SOT23_BSS84_PACKAGE]
R6  270  R-US_R0603  [R0603]
R7  12.1k  R-US_R0603  [R0603]
R8  zero_ohm  R-US_R1206W  [R1206W]
R9  10  R-US_R0603  [R0603]
R10  270  R-US_R0603  [R0603]
R11  10  R-US_R0603  [R0603]
R12  10  R-US_R0603  [R0603]
R13  10  R-US_R0603  [R0603]
R14  10  R-US_R0603  [R0603]
R15  10  R-US_R0603  [R0603]
R16  10  R-US_R0603  [R0603]
R17  10  R-US_R0603  [R0603]
R18  10  R-US_R0603  [R0603]
R19  10  R-US_R0603  [R0603]
R20  10  R-US_R0603  [R0603]
R21  10  R-US_R0603  [R0603]
R22  10  R-US_R0603  [R0603]
R27  10  R-US_R0603  [R0603]
R28  10  R-US_R0603  [R0603]
R29  10  R-US_R0603  [R0603]
R30  10  R-US_R0603  [R0603]
R31  10  R-US_R0603  [R0603]
R32  10  R-US_R0603  [R0603]
R33  10  R-US_R0603  [R0603]
R34  10  R-US_R0603  [R0603]
R35  DNP  R-US_R1206W  [R1206W]
R39  10  R-US_R0603  [R0603]
R40  10  R-US_R0603  [R0603]
R41  10  R-US_R0603  [R0603]
R42  10  R-US_R0603  [R0603]
R43  10  R-US_R0603  [R0603]
R44  10  R-US_R0603  [R0603]
R45  10  R-US_R0603  [R0603]
R46  10  R-US_R0603  [R0603]
R47  10  R-US_R0603  [R0603]
R48  10  R-US_R0603  [R0603]
R51  10  R-US_R0603  [R0603]
R52  270  R-US_R0603  [R0603]
R53  270  R-US_R0603  [R0603]
R54  270  R-US_R0603  [R0603]
U2  ICE40HX8K-CT256  [CABGA256]
U11  MP34DT05TR-A  MICROPHONE-MP34DT01  [HCLGA5P-3X4X1MM]

### Nets
3V3: C3.1 C4.1 C10.1 C11.1 C12.1 C13.1 C14.1 C15.1 D1.A D2.A J3.2 J3.3 JP2.6 JP5.6 JP6.6 JP7.6 Q17.2(S) R7.2 R35.1 U2.A3(A:VCCIO_0_2) U2.A8(A:VCCIO_0_3) U2.A13(B:VCCIO_0) U2.C15(B:VCCIO_1) U2.E1(A:VCCIO_3_2) U2.F8(A:VCCIO_0) U2.G6(A:VCCIO_3_3) U2.H10(C:VCCIO_1_2) U2.H15(C:VCCIO_1_3) U2.J6(A:VCCIO_3) U2.K8(B:VCCIO_2_2) U2.N1(B:VCCIO_3) U2.N13(C:VCC_SPI) U2.N15(C:VCCIO_1) U2.P3(B:VCCIO_2_3) U2.R8(B:VCCIO_2) U2.R13(C:VCCIO_2) U11.1(VDD) ; also sheet 1,2,3,5,6,7
+5V: R8.1 ; also sheet 3,7
ADDR0: U2.C16(B:IOR_161) ; also sheet 1
ADDR1: U2.T15(C:IOB_91) ; also sheet 1
ADDR2: U2.R16(C:IOB_102) ; also sheet 1
ADDR3: U2.R15(C:IOR_110) ; also sheet 1
ADDR4: U2.P16(C:IOR_113) ; also sheet 1
ADDR5: U2.P15(C:IOR_112) ; also sheet 1
ADDR6: U2.N16(C:IOR_117) ; also sheet 1
ADDR7: U2.M16(C:IOR_121) ; also sheet 1
ADDR8: U2.M15(C:IOR_123) ; also sheet 1
ADDR9: U2.L16(C:IOR_127) ; also sheet 1
ADDR10: U2.T14(C:IOB_92) ; also sheet 1
ADDR11: U2.R14(C:IOR_109) ; also sheet 1
ADDR12: U2.P14(C:IOR_111) ; also sheet 1
ADDR13: U2.L14(C:IOR_119) ; also sheet 1
ADDR14: U2.D14(B:IOR_167) ; also sheet 1
ADDR15: U2.C14(B:IOT_168) ; also sheet 1
BL_A: J3.17 R52.1 R53.1 R54.1
CBSEL: U2.P13(C:IOB_104_CBSEL1) ; also sheet 1
CDONE: U2.M10(C:CDONE) ; also sheet 1
CRESET_B: U2.N11(C:CRESET_B) ; also sheet 1
CSB: J3.4 U2.B5(A:IOT_214)
DATA0: U2.D16(B:IOR_153) ; also sheet 1
DATA1: U2.D15(B:IOR_157) ; also sheet 1
DATA2: U2.B16(B:IOR_165) ; also sheet 1
DATA3: U2.B15(B:IOT_169) ; also sheet 1
DATA4: U2.A16(B:IOT_176) ; also sheet 1
DATA5: U2.A15(B:IOT_177) ; also sheet 1
DATA6: U2.E16(C:IOR_151) ; also sheet 1
DATA7: U2.F15(C:IOR_149) ; also sheet 1
DATA8: U2.F16(C:IOR_147) ; also sheet 1
DATA9: U2.G15(C:IOR_145) ; also sheet 1
DATA10: U2.G16(C:IOR_143) ; also sheet 1
DATA11: U2.J15(C:IOR_130) ; also sheet 1
DATA12: U2.J16(C:IOR_138) ; also sheet 1
DATA13: U2.K15(C:IOR_131) ; also sheet 1
DATA14: U2.K16(C:IOR_133) ; also sheet 1
DATA15: U2.T16(C:IOB_100) ; also sheet 1
DB0: J3.9 U2.A6(A:IOT_211)
DB1: J3.10 U2.A7(A:IOT_205)
DB2: J3.11 U2.A9(A:IOT_194)
DB3: J3.12 U2.A10(B:IOT_186)
DB4: J3.13 U2.A11(B:IOT_187)
DB5: J3.14 U2.B6(A:IOT_208)
DB6: J3.15 U2.B7(A:IOT_207)
DB7: J3.16 U2.B8(A:IOT_203)
EXP_PIN12_VOLT: JP2.12 JP5.12 JP6.12 JP7.12 R8.2 R35.2
F_LRCLK: U2.G14(C:IOR_150) ; also sheet 2
F_MCLK: U2.H16(C:IOR_141_GBIN2) ; also sheet 2
F_SCLK: U2.H11(C:IOR_140_GBIN3) ; also sheet 2
F_SDIN: U2.E14(C:IOR_160) ; also sheet 2
FPGA_CFG_CS: U2.R12(C:IOB_108_SS) ; also sheet 2
FPGA_VCC_1V2: U2.A14(B:VCC) U2.F6(A:VCC) U2.F10(C:VCC_2) U2.K6(B:VCC_2) U2.K10(C:VCC) U2.L2(B:VCC_3) ; also sheet 7
FSMC_CLK: U2.K9(B:IOB_82_GBIN4) ; also sheet 1
FSMC_NE1: U2.J14(C:IOR_134) ; also sheet 1
FSMC_NE4: U2.K14(C:IOR_129) ; also sheet 1
FSMC_NL_NADV: U2.B14(B:IOT_171) ; also sheet 2
FSMC_NOE: U2.F14(C:IOR_155) ; also sheet 1
FSMC_NWE: U2.H14(C:IOR_142) ; also sheet 1
GB0_CE: U2.F7(A:IOT_198_GBIN0)
GB1_RST: U2.C8(A:IOT_197_GBIN1)
GB6_CE: U2.J3(A:IOL_14A_GBIN6)
GB7_RST: U2.G1(A:IOL_13B_GBIN7)
GND: C3.2 C4.2 C10.2 C11.2 C12.2 C13.2 C14.2 C15.2 J3.1 J3.18 J3.19 J3.20 JP2.5 JP2.11 JP4.5 JP5.5 JP5.11 JP6.5 JP6.11 JP7.5 JP7.11 U2.A4(A:GND_2) U2.A12(B:GND) U2.E7(A:GNDPLL1) U2.E15(C:GND_2) U2.G7(A:GND_3) U2.G8(A:GND_4) U2.G9(A:GND_5) U2.H7(A:GND_6) U2.H8(A:GND_7) U2.H9(A:GND_8) U2.J7(A:GND_9) U2.J8(A:GND_10) U2.J9(A:GND_11) U2.K2(A:GND) U2.K7(B:GND_2) U2.L15(C:GND_3) U2.N8(B:GNDPLL0) U2.R7(B:GND_3) U2.T4(B:GND_4) U2.T12(C:GND) U11.2(LR) U11.5(GND) U11.6(GND) U11.7(GND) U11.8(GND) ; also sheet 2,3,5,6,7
LED_F1: R10.2 U2.A1(A:IOT_220)
LED_F2: R6.2 U2.A2(A:IOT_218)
LRCLK: U2.T6(B:IOB_73) ; also sheet 6
MC02_SYSCLK: U2.R9(B:IOB_81_GBIN5) ; also sheet 2
MCLK: U2.T5(B:IOB_69) ; also sheet 6
MCU_SPI3_MISO: U2.N12(C:IOB_98) ; also sheet 2
MCU_SPI3_MOSI: U2.P10(C:IOB_86) U2.P11(C:IOB_106_SDI) ; also sheet 2
MCU_SPI3_SCLK: U2.R10(C:IOB_84) U2.R11(C:IOB_107_SCK) ; also sheet 2
MIC_CLK: U2.R6(B:IOB_71) U11.3(CLK)
MIC_DOUT: U2.R5(B:IOB_60) U11.4(DOUT)
N$1: Q17.3(D) R52.2 R53.2 R54.2
N$5: D1.C R10.1
N$6: D2.C R6.1
N$10: JP5.1 R9.2
N$11: JP5.2 R11.2
N$12: JP5.3 R12.2
N$13: JP5.4 R13.2
N$14: JP5.10 R17.1
N$15: JP5.9 R16.1
N$16: JP5.8 R15.1
N$17: JP5.7 R14.1
N$39: JP6.1 R18.2
N$40: JP6.2 R19.2
N$41: JP6.3 R20.2
N$42: JP6.4 R21.2
N$47: JP6.7 R22.1
N$48: JP6.8 R27.1
N$49: JP6.9 R28.1
N$50: JP6.10 R29.1
N$60: JP7.1 R30.2
N$61: JP7.2 R31.2
N$65: JP7.3 R32.2
N$67: JP7.4 R33.2
N$73: JP7.7 R34.1
N$78: JP7.8 R39.1
N$79: JP7.9 R40.1
N$80: JP7.10 R41.1
N$85: JP2.1 R42.2
N$86: JP2.2 R43.2
N$87: JP2.3 R44.2
N$88: JP2.4 R45.2
N$89: JP2.7 R46.1
N$90: JP2.8 R47.1
N$91: JP2.9 R48.1
N$92: JP2.10 R51.1
PLL_VCC_1V2: U2.E8(A:VCCPLL1) U2.L8(B:VCCPLL0) ; also sheet 7
PMOD1_1: R42.1 U2.P2(B:IOL_25A)
PMOD1_2: R43.1 U2.R2(B:IOB_55)
PMOD1_3: R44.1 U2.T1(B:IOB_53)
PMOD1_4: R45.1 U2.T3(B:IOB_61)
PMOD1_7: R46.2 U2.P1(B:IOL_24A)
PMOD1_8: R47.2 U2.R1(B:IOL_26A)
PMOD1_9: R48.2 U2.R3(B:IOB_59)
PMOD1_10: R51.2 U2.T2(B:IOB_57)
PMOD2_1: R30.1 U2.K1(A:IOL_16A)
PMOD2_2: R31.1 U2.L3(B:IOL_19B)
PMOD2_3: R32.1 U2.M2(B:IOL_20B)
PMOD2_4: R33.1 U2.N3(B:IOL_23B)
PMOD2_7: R34.2 U2.K3(A:IOL_16B)
PMOD2_8: R39.2 U2.L1(B:IOL_17B)
PMOD2_9: R40.2 U2.M1(B:IOL_18B)
PMOD2_10: R41.2 U2.N2(B:IOL_21B)
PMOD3_1: R18.1 U2.F2(A:IOL_9B)
PMOD3_2: R19.1 U2.G3(A:IOL_8A)
PMOD3_3: R20.1 U2.H1(A:IOL_14B)
PMOD3_4: R21.1 U2.J2(A:IOL_15A)
PMOD3_7: R22.2 U2.F1(A:IOL_10B)
PMOD3_8: R27.2 U2.G2(A:IOL_11B)
PMOD3_9: R28.2 U2.H2(A:IOL_12B)
PMOD3_10: R29.2 U2.J1(A:IOL_15B)
PMOD4_1: R9.1 U2.B3(A:IOT_223)
PMOD4_2: R11.1 U2.C3(A:IOT_227)
PMOD4_3: R12.1 U2.D3(A:IOT_226)
PMOD4_4: R13.1 U2.E3(A:IOL_6B)
PMOD4_7: R14.2 U2.B2(A:IOL_1B)
PMOD4_8: R15.2 U2.C2(A:IOL_3B)
PMOD4_9: R16.2 U2.D2(A:IOL_4B)
PMOD4_10: R17.2 U2.E2(A:IOL_7B)
RDB: J3.8 U2.A5(A:IOT_213)
RS: J3.6 U2.B11(B:IOT_184)
RST: J3.5 U2.B4(A:IOT_216)
SCLK: U2.T7(B:IOB_75) ; also sheet 6
SDIN: U2.T8(B:IOB_76) ; also sheet 6
TFT_BL_EN: Q17.1(G) R7.1 ; also sheet 2
TOUCH_XL: J3.22 JP4.2 ; also sheet 2
TOUCH_XR: J3.24 JP4.4 ; also sheet 2
TOUCH_YD: J3.23 JP4.3 ; also sheet 2
TOUCH_YU: J3.21 JP4.1 ; also sheet 2
VPP_2V5: U2.E12(C:VPP_2V5) ; also sheet 7
WRB: J3.7 U2.B9(A:IOT_199)
Unconnected: U2.B1(A:IOL_2B) U2.B10(B:IOT_183) U2.B12(B:IOT_182) U2.B13(B:IOT_178) U2.C1(A:IOL_3A) U2.C4(A:IOT_222) U2.C5(A:IOT_221) U2.C6(A:IOT_209) U2.C7(A:IOT_206) U2.C9(A:IOT_191) U2.C10(B:IOT_185) U2.C11(B:IOT_180) U2.C12(B:IOT_172) U2.C13(B:IOT_174) U2.D1(A:IOL_5B) U2.D4(A:IOT_224) U2.D5(A:IOT_219) U2.D6(A:IOT_212) U2.D7(A:IOT_210) U2.D8(A:IOT_200) U2.D9(A:IOT_193) U2.D10(B:IOT_190) U2.D11(B:IOT_181) U2.D13(B:IOT_170) U2.E4(A:IOL_1A) U2.E5(A:IOT_225) U2.E6(A:IOT_215) U2.E9(A:IOT_192) U2.E10(C:IOT_179) U2.E11(C:IOT_173) U2.E13(C:IOR_166) U2.F3(A:IOL_8B) U2.F4(A:IOL_4A) U2.F5(A:IOL_2A) U2.F9(A:IOT_196) U2.F11(C:IOR_158) U2.F12(C:IOR_156) U2.F13(C:IOR_162) U2.G4(A:IOL_6A) U2.G5(A:IOL_5A) U2.G10(C:IOR_146) U2.G11(C:IOR_148) U2.G12(C:IOR_154) U2.G13(C:IOR_152) U2.H3(A:IOL_9A) U2.H4(A:IOL_11A) U2.H5(A:IOL_7A) U2.H6(A:IOL_10A) U2.H12(C:IOR_144) U2.H13(C:IOR_139) U2.J4(A:IOL_12A) U2.J5(A:IOL_13A) U2.J10(C:IOR_122) U2.J11(C:IOR_126) U2.J12(C:IOR_136) U2.J13(C:IOR_137) U2.K4(A:IOL_18A) U2.K5(A:IOL_20A) U2.K11(C:IOB_103_CBSEL0) U2.K12(C:IOR_120) U2.K13(C:IOR_128) U2.L4(B:IOL_17A) U2.L5(B:IOL_23A) U2.L6(B:IOL_19A) U2.L7(B:IOL_21A) U2.L9(B:IOB_74) U2.L10(C:IOB_85) U2.L11(C:IOB_99) U2.L12(C:IOR_116) U2.L13(C:IOR_118) U2.M3(B:IOL_22B) U2.M4(B:IOL_24B) U2.M5(B:IOL_25B) U2.M6(B:IOL_22A) U2.M7(B:IOB_64) U2.M8(B:IOB_68) U2.M9(B:IOB_80) U2.M11(C:IOB_93) U2.M12(C:IOB_101) U2.M13(C:IOR_114) U2.M14(C:IOR_115) U2.N4(B:IOL_26B) U2.N5(B:IOB_56) U2.N6(B:IOB_52) U2.N7(B:IOB_66) U2.N9(B:IOB_78) U2.N10(C:IOB_87) U2.N14(C:NC) U2.P4(B:IOB_54) U2.P5(B:IOB_58) U2.P6(B:IOB_67) U2.P7(B:IOB_77) U2.P8(B:IOB_72) U2.P9(B:IOB_83) U2.P12(C:IOB_105_SDO) U2.R4(B:IOB_63) U2.T9(B:IOB_79) U2.T10(C:IOB_88) U2.T11(C:IOB_89) U2.T13(C:IOB_94)

### Buses
AUDIO_IO:SDIN,SCLK,LRCLK,MCLK
DATA[0..15]
ADDR[0..15]
AUDIO_IO_MCU:F_SDIN,F_SCLK,F_LRCLK,F_MCLK

### Notes on the sheet
- 5mA | 5mA
- PMOD2 | PMOD1
- PMOD4 | PMOD3
- NC
- USE TFT DISPLAY NHD-1.8-128160EF-CTXI#-T
- LCD-CONN FFC TOP 24POS 0.50MM R/A
- XR
- YD
- XL | PDM Microphone
- YU
- K2
- K1
- t.elliott
- VCC
- IOVCC
- 1

## Sheet 5 of 7
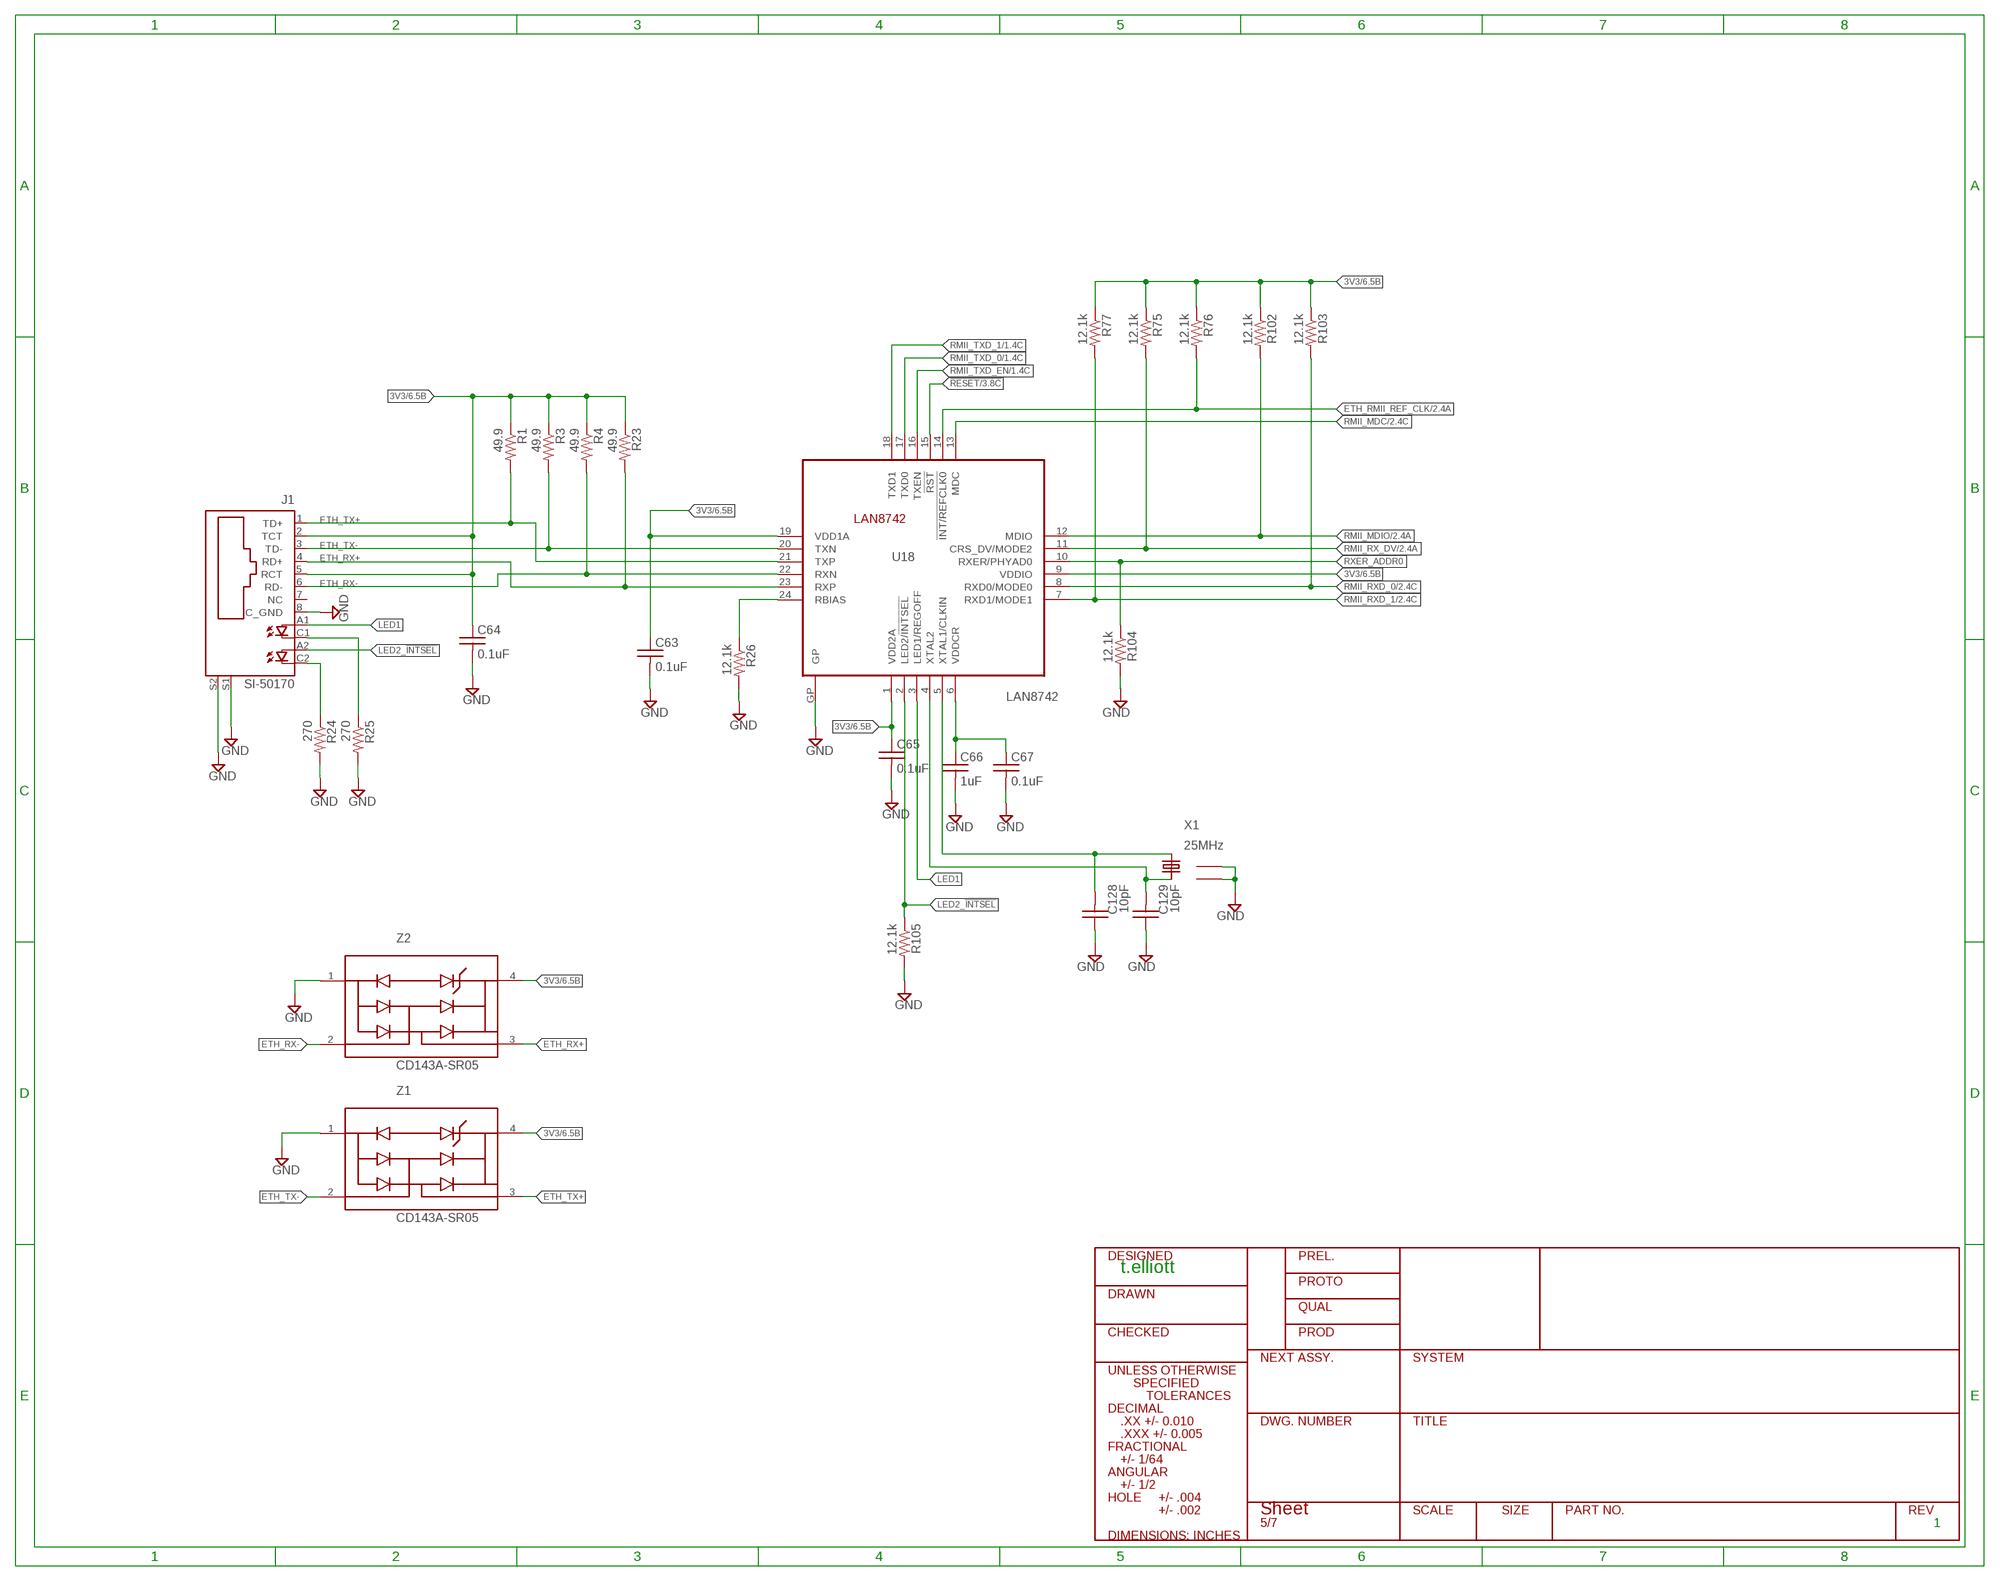
[diagram p5: schematic, sheet 5]

### Parts
C63  0.1uF  C-USC0603  [C0603]
C64  0.1uF  C-USC0603  [C0603]
C65  0.1uF  C-USC0603  [C0603]
C66  1uF  C-USC0603  [C0603]
C67  0.1uF  C-USC0603  [C0603]
C128  10pF  C-USC0402  [C0402]
C129  10pF  C-USC0402  [C0402]
J1  SI-50170  [SI-50170]
R1  49.9  R-US_R0603  [R0603]
R3  49.9  R-US_R0603  [R0603]
R4  49.9  R-US_R0603  [R0603]
R23  49.9  R-US_R0603  [R0603]
R24  270  R-US_R0603  [R0603]
R25  270  R-US_R0603  [R0603]
R26  12.1k  R-US_R0603  [R0603]
R75  12.1k  R-US_R0603  [R0603]
R76  12.1k  R-US_R0603  [R0603]
R77  12.1k  R-US_R0603  [R0603]
R102  12.1k  R-US_R0603  [R0603]
R103  12.1k  R-US_R0603  [R0603]
R104  12.1k  R-US_R0603  [R0603]
R105  12.1k  R-US_R0603  [R0603]
U18  LAN8742  [QFN-24]
X1  25MHz  ECS-250-20-30B-DUDU  [ECS-250-20-30B-DU_CRYSTAL]
Z1  CD143A-SR05  SR2.8_TVS  [SR2.8.TCT_1PRIMARY]
Z2  CD143A-SR05  SR2.8_TVS  [SR2.8.TCT_1PRIMARY]

### Nets
3V3: C63.1 C64.1 C65.1 J1.2(TCT) J1.5(RCT) R1.1 R3.1 R4.1 R23.1 R75.1 R76.1 R77.1 R102.1 R103.1 U18.1(VDD2A) U18.9(VDDIO) U18.19(VDD1A) Z1.4(REF) Z2.4(REF) ; also sheet 1,2,3,4,6,7
!RESET: U18.15(!RST) ; also sheet 3
ETH_RMII_REF_CLK: R76.2 U18.14(!INT/REFCLK0) ; also sheet 2
ETH_RX+: J1.4(RD+) R23.2 U18.23(RXP) Z2.3(I/O)
ETH_RX-: J1.6(RD-) R4.2 U18.22(RXN) Z2.2(I/O)
ETH_TX+: J1.1(TD+) R1.2 U18.21(TXP) Z1.3(I/O)
ETH_TX-: J1.3(TD-) R3.2 U18.20(TXN) Z1.2(I/O)
GND: C63.2 C64.2 C65.2 C66.2 C67.2 C128.1 C129.1 J1.8(C_GND) J1.S1 J1.S2 R24.2 R25.2 R26.2 R104.2 R105.2 U18.GP X1.GND@1 X1.GND@2 Z1.1(GND) Z2.1(GND) ; also sheet 2,3,4,6,7
LED1: J1.A1(A) U18.3(LED1/REGOFF)
LED2_!INTSEL: J1.A2(A1) R105.1 U18.2(LED2/!INTSEL)
N$96: R26.1 U18.24(RBIAS)
N$98: C66.1 C67.1 U18.6(VDDCR)
N$99: J1.C2(C1) R24.1
N$100: J1.C1(C) R25.1
N$114: C129.2 U18.4(XTAL2) X1.3
N$115: C128.2 U18.5(XTAL1/CLKIN) X1.1
RMII_MDC: U18.13(MDC) ; also sheet 2
RMII_MDIO: R102.2 U18.12(MDIO) ; also sheet 2
RMII_RX_DV: R75.2 U18.11(CRS_DV/MODE2) ; also sheet 2
RMII_RXD_0: R103.2 U18.8(RXD0/MODE0) ; also sheet 2
RMII_RXD_1: R77.2 U18.7(RXD1/MODE1) ; also sheet 2
RMII_TXD_0: U18.17(TXD0) ; also sheet 1
RMII_TXD_1: U18.18(TXD1) ; also sheet 1
RMII_TXD_EN: U18.16(TXEN) ; also sheet 1
RXER_ADDR0: R104.1 U18.10(RXER/PHYAD0)
Unconnected: J1.7(NC)

### Notes on the sheet
- t.elliott
- 1

## Sheet 6 of 7
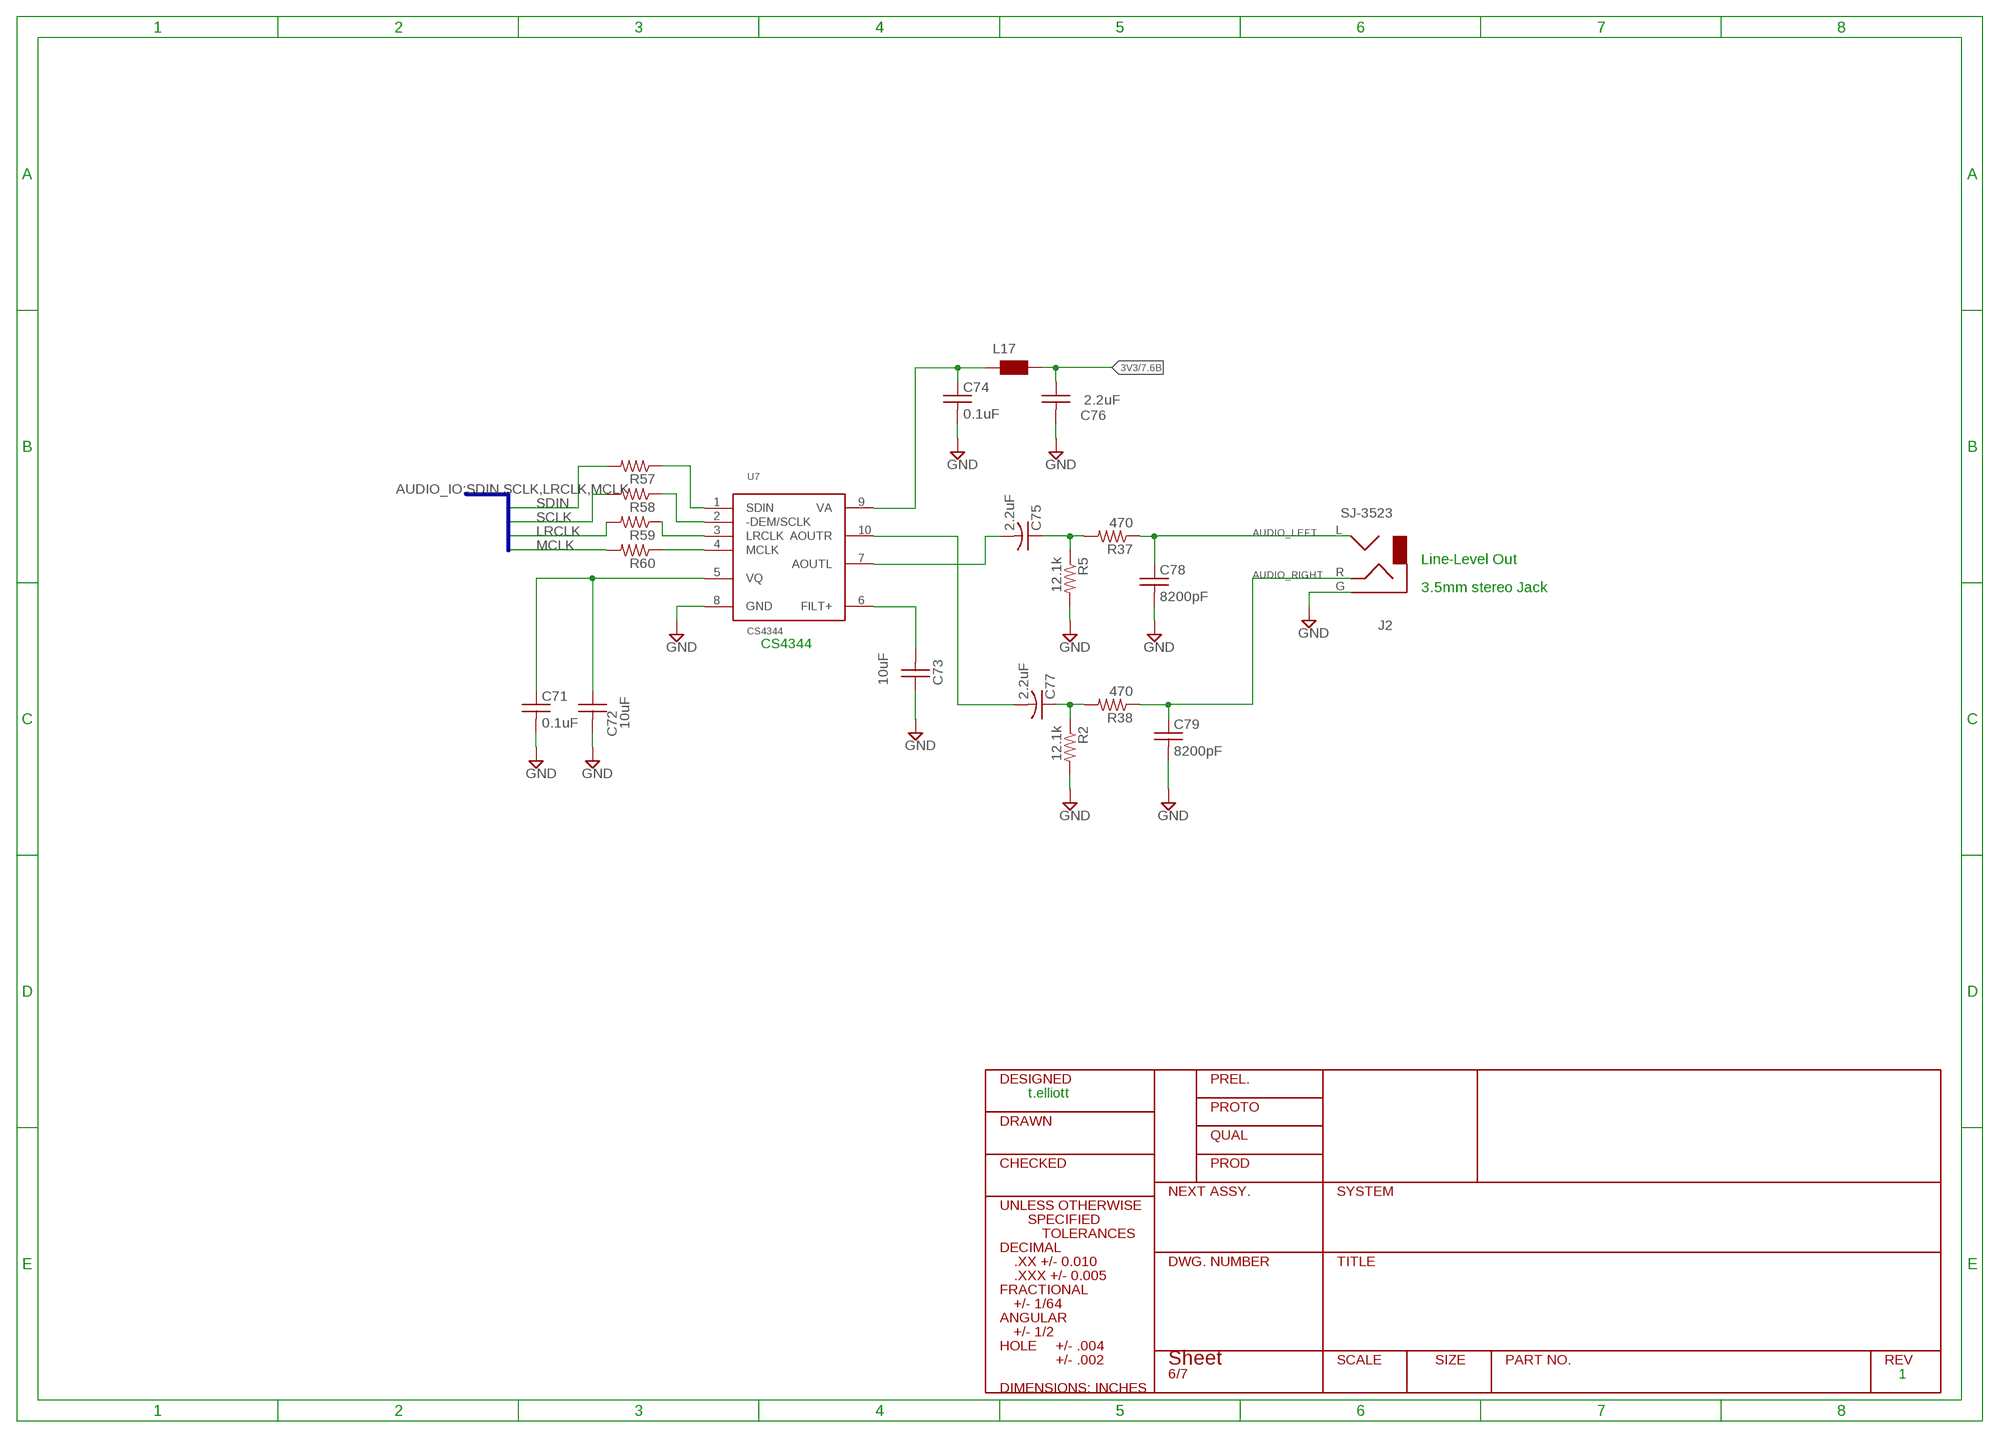
[diagram p6: schematic, sheet 6]

### Parts
C71  0.1uF  C-USC0603  [C0603]
C72  10uF  C-USC0805  [C0805]
C73  10uF  C-USC0805  [C0805]
C74  0.1uF  C-USC0603  [C0603]
C75  2.2uF  C-USC0805  [C0805]
C76  2.2uF  C-USC0805  [C0805]
C77  2.2uF  C-USC0805  [C0805]
C78  8200pF  C-USC0603  [C0603]
C79  8200pF  C-USC0603  [C0603]
J2  SJ-3523  CUI_SJ-3523SMT  [SJ-3523]
L17  WE-CBF_0603  [0603]
R2  12.1k  R-US_R0603  [R0603]
R5  12.1k  R-US_R0603  [R0603]
R37  470  R-US_R0402  [R0402]
R38  470  R-US_R0402  [R0402]
R57  470  R-US_R0402  [R0402]
R58  470  R-US_R0402  [R0402]
R59  470  R-US_R0402  [R0402]
R60  470  R-US_R0402  [R0402]
U7  CS4344  [MSOP10]

### Nets
3V3: C76.1 L17.2 ; also sheet 1,2,3,4,5,7
AUDIO_LEFT: C79.1 J2.R R38.1
AUDIO_RIGHT: C78.1 J2.L R37.1
GND: C71.2 C72.2 C73.1 C74.2 C76.2 C78.2 C79.2 J2.G R2.2 R5.2 U7.8(GND) ; also sheet 2,3,4,5,7
LRCLK: R59.2 ; also sheet 4
MCLK: R60.2 ; also sheet 4
N$20: C77.2 U7.10(AOUTR)
N$25: R60.1 U7.4(MCLK)
N$26: R59.1 U7.3(LRCLK)
N$27: R58.1 U7.2(-DEM/SCLK)
N$29: R57.1 U7.1(SDIN)
N$51: C73.2 U7.6(FILT+)
N$53: C71.1 C72.1 U7.5(VQ)
N$54: C75.2 U7.7(AOUTL)
N$56: C75.1 R5.1 R37.2
N$57: C77.1 R2.1 R38.2
N$66: C74.1 L17.1 U7.9(VA)
SCLK: R58.2 ; also sheet 4
SDIN: R57.2 ; also sheet 4

### Buses
AUDIO_IO:SDIN,SCLK,LRCLK,MCLK

### Notes on the sheet
- Line-Level Out
- 3.5mm stereo Jack
- CS4344
- t.elliott
- 1

## Sheet 7 of 7
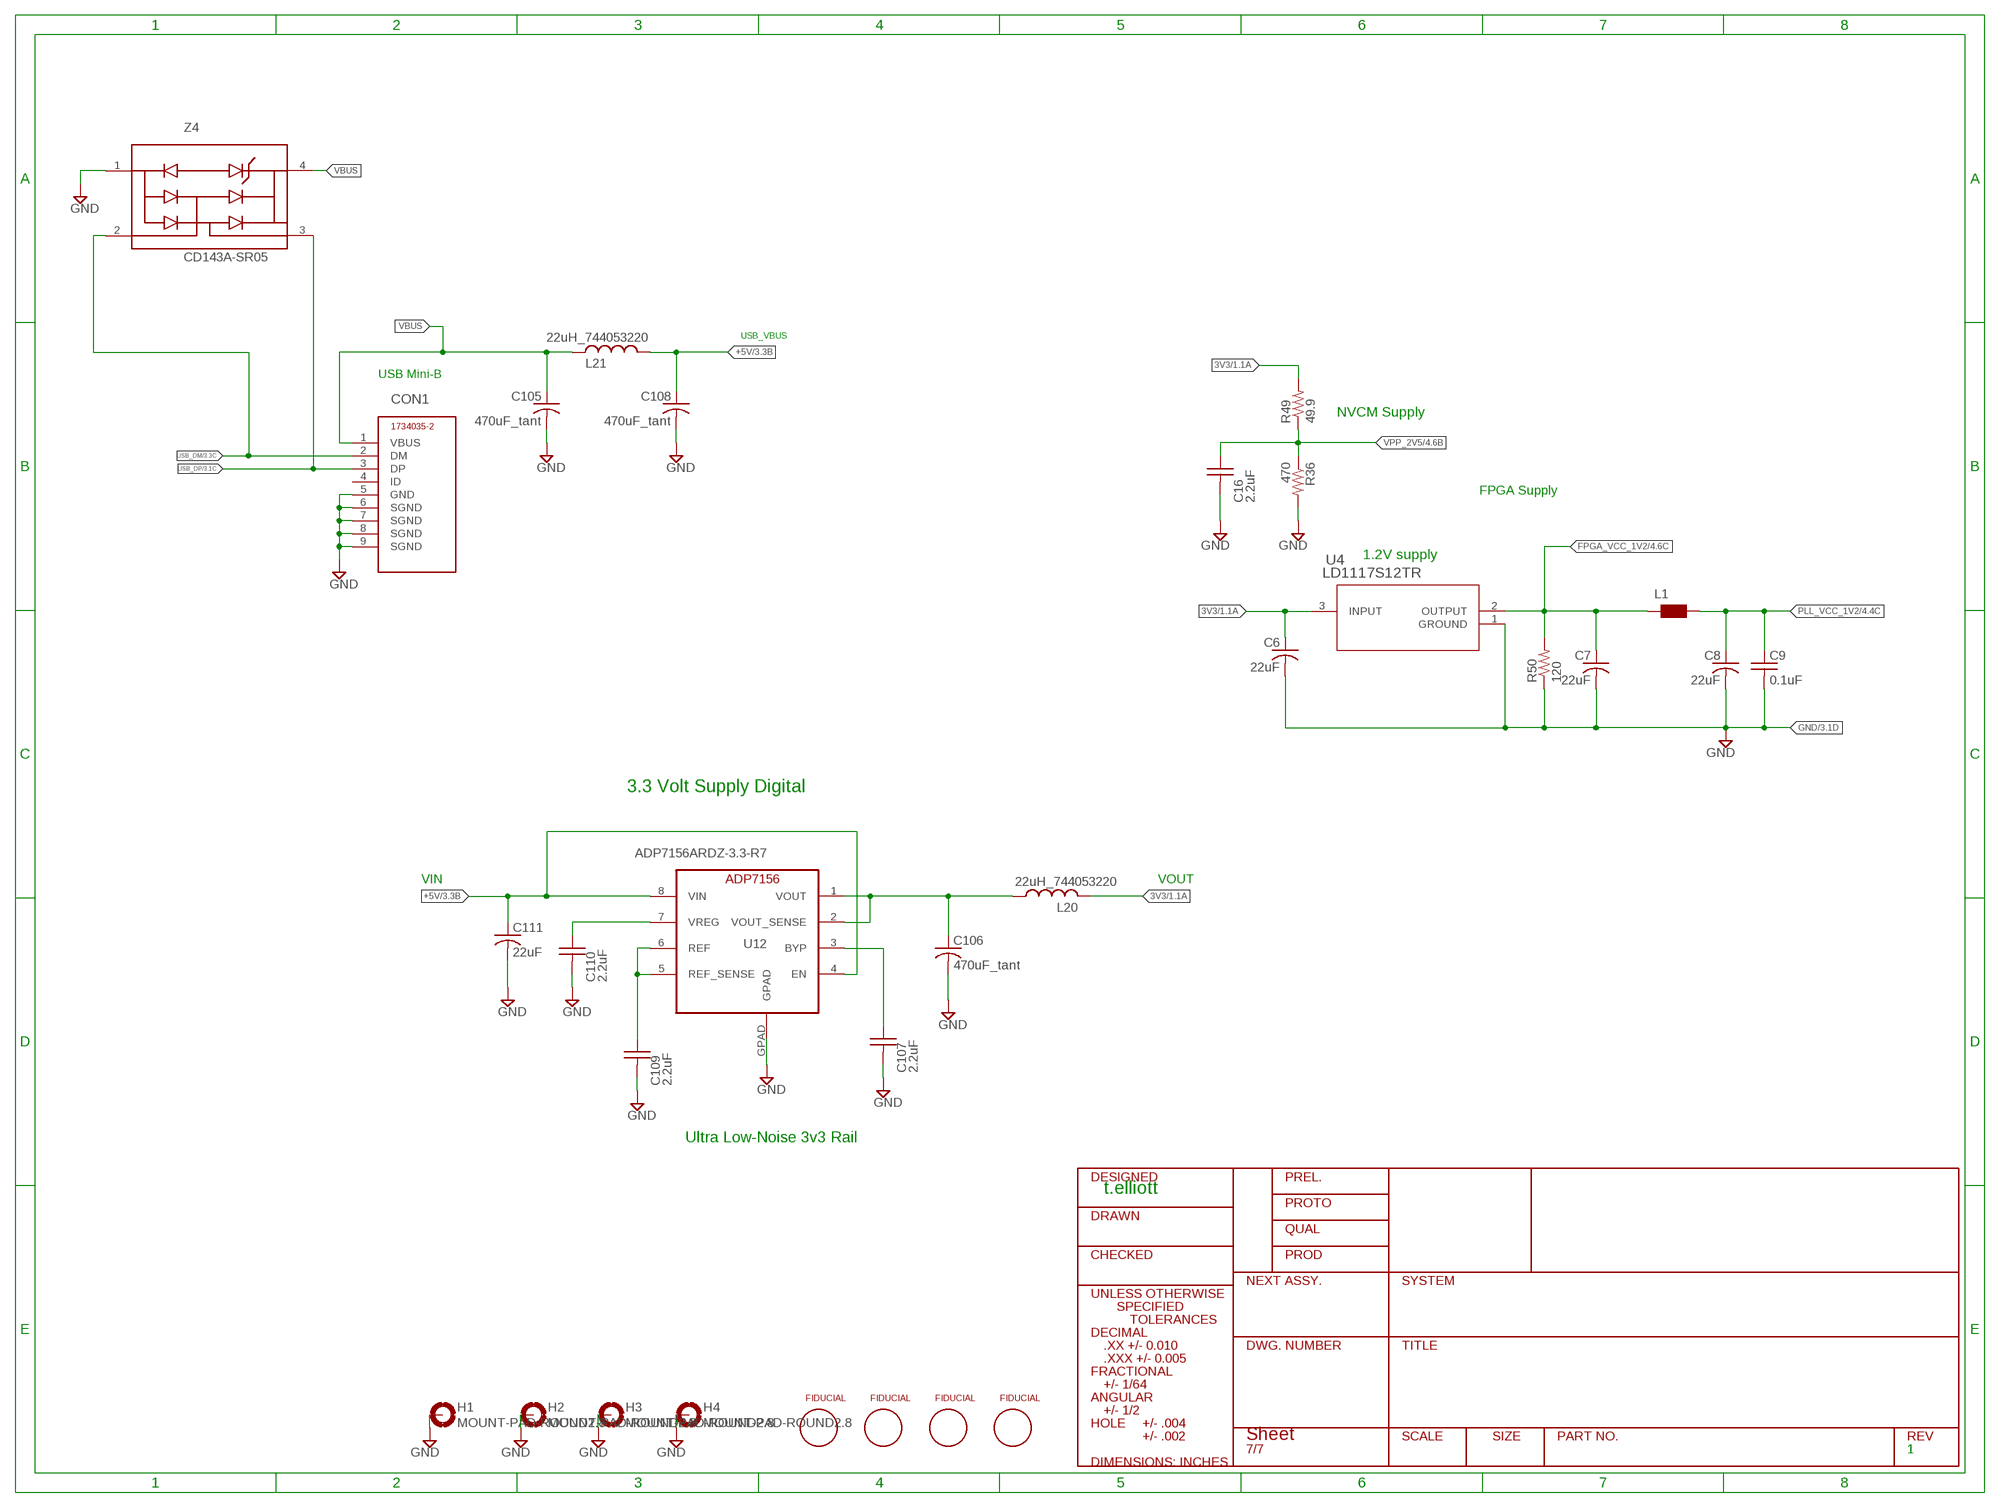
[diagram p7: schematic, sheet 7]

### Parts
C6  22uF  CAPACITOR1210K  [1210K]
C7  22uF  CAPACITOR1210K  [1210K]
C8  22uF  CAPACITOR1210K  [1210K]
C9  0.1uF  C-USC0603  [C0603]
C16  2.2uF  C-USC0805  [C0805]
C105  470uF_tant  CAPACITOR1210K  [1210K]
C106  470uF_tant  CAPACITOR1210K  [1210K]
C107  2.2uF  C-USC0805  [C0805]
C108  470uF_tant  CAPACITOR1210K  [1210K]
C109  2.2uF  C-USC0805  [C0805]
C110  2.2uF  C-USC0805  [C0805]
C111  22uF  CAPACITOR1210K  [1210K]
CON1  1734035-2  [1734035-2]
FID1  FIDUCIALSMD  [FIDUCIAL]
FID2  FIDUCIALSMD  [FIDUCIAL]
FID3  FIDUCIALSMD  [FIDUCIAL]
FID4  FIDUCIALSMD  [FIDUCIAL]
H1  MOUNT-PAD-ROUND2.8  [2,8-PAD]
H2  MOUNT-PAD-ROUND2.8  [2,8-PAD]
H3  MOUNT-PAD-ROUND2.8  [2,8-PAD]
H4  MOUNT-PAD-ROUND2.8  [2,8-PAD]
L1  WE-CBF_0603  [0603]
L20  22uH_744053220  L-USWE-TPC  [POWER-CHOKE_WE-TPC]
L21  22uH_744053220  L-USWE-TPC  [POWER-CHOKE_WE-TPC]
R36  470  R-US_R0402  [R0402]
R49  49.9  R-US_R0603  [R0603]
R50  120  R-US_R0603  [R0603]
U4  LD1117S12TR  [SOT-223]
U12  ADP7156ARDZ-3.3-R7  ADP7156SO8  [SO8]
Z4  CD143A-SR05  SR2.8_TVS  [SR2.8.TCT_1PRIMARY]

### Nets
3V3: C6.A L20.2 R49.2 U4.3(INPUT) ; also sheet 1,2,3,4,5,6
+5V: C108.A C111.A L21.1 U12.4(EN) U12.8(VIN) ; also sheet 3,4
FPGA_VCC_1V2: C7.A L1.1 R50.2 U4.2(OUTPUT) ; also sheet 4
GND: C6.C C7.C C8.C C9.2 C16.2 C105.C C106.C C107.2 C108.C C109.2 C110.2 C111.C CON1.5(GND) CON1.6(SGND) CON1.7(SGND) CON1.8(SGND) CON1.9(SGND) H1.B2,8(MOUNT) H2.B2,8(MOUNT) H3.B2,8(MOUNT) H4.B2,8(MOUNT) R36.2 R50.1 U4.1(GROUND) U12.GPAD Z4.1(GND) ; also sheet 2,3,4,5,6
N$68: C106.A L20.1 U12.1(VOUT) U12.2(VOUT_SENSE)
N$74: C109.1 U12.5(REF_SENSE) U12.6(REF)
N$76: C110.1 U12.7(VREG)
N$77: C107.1 U12.3(BYP)
PLL_VCC_1V2: C8.A C9.1 L1.2 ; also sheet 4
USB_DM: CON1.2(DM) Z4.2(I/O) ; also sheet 3
USB_DP: CON1.3(DP) Z4.3(I/O) ; also sheet 3
VBUS: C105.A CON1.1(VBUS) L21.2 Z4.4(REF)
VPP_2V5: C16.1 R36.1 R49.1 ; also sheet 4
Unconnected: CON1.4(ID)

### Notes on the sheet
- USB_VBUS
- USB Mini-B
- NVCM Supply
- FPGA Supply
- 1.2V supply
- 3.3 Volt Supply Digital
- VIN | VOUT
- Ultra Low-Noise 3v3 Rail
- t.elliott
- 1

## Power pins joined to a net without a drawn wire
VPP_FAST: U2.D12(B:VPP_FAST)

## Library data of the parts
C1 C2 C9 C16 C71-C74 C76 C78 C79 C103 C107 C109 C110 = misclib3:C-US: CAPACITOR, American symbol
C3-C5 C10-C15 C21 C63-C67 C128 C129 = misc9:C-US: CAPACITOR, American symbol
C6-C8 C40 C85-C92 C94 C96 C98 C99 C101 C105 C106 C108 C111 = misclib4:CAPACITOR
C75 C77 C100 C102 = resistor:C-US: CAPACITOR, American symbol
CON1 = misclib1:1734035-2
D1 D2 D5-D7 = SparkFun-LED:LED: LED (Generic) Standard schematic elements and footprints for 5mm, 3mm, 1206, and 0603 sized LEDs. Generic LEDs with no color specified.
FID1-FID4 = misclib2:FIDUCIAL
H1-H4 = holes:MOUNT-PAD-ROUND: MOUNTING PAD, round
J1 = con-stewart:SI-50170: Ethernet Connector MagJack (R) Source: www.stewartconnector.com .. si-50170.pdf; OC_FARNELL: unknown; OC_NEWARK: unknown
J2 = misclib3:CUI_SJ-3523
J3 = con-molex:52745-2490: FFC/FPC-to-Board 0.50mm (.020") SMT Top Contact Right Angle, ZIF, Style Receptacle 52745 / 52435 Source: http://www.molex.com/product/ffc/52745.html; OC_FARNELL: unknown; OC_NEWARK: unknown
J5 = molex_sd_new:SD-502774-001
JP1 = pinhead:PINHD-1X6: PIN HEADER
JP2 JP5-JP7 = pinhead:PINHD-2X6: PIN HEADER
JP3 = pinhead:PINHD-1X2: PIN HEADER
JP4 = pinhead:PINHD-1X5: PIN HEADER
L1 L17 L19 = wuerth-elektronik:WE-CBF: SMD EMI Suppression Ferrite Beads - excellent anti-EMI properties - low DCR - impedances till 3000 ohms - rated current up to 6 A
L20 L21 = rcl:L-US: INDUCTOR, American symbol
Q17 = fets:BSS84
R1-R7 R9-R34 R39-R54 R56 R61-R63 R75-R77 R102-R105 = misc9:R-US_: RESISTOR, American symbol
R8 R35 = resistor:R-US_: RESISTOR, American symbol
R36-R38 R57-R60 = misclib3:R-US_: RESISTOR, American symbol
SW3 = misc9:HOKURIKU_KSM06_6X6MM_SWITCH
TP1 = testpad:PTR1: TEST PIN
U2 = lattice_8k_ct256:ICE40HX8K-CT256; MANUFACTURER_PART_NUMBER: ICE40HX8KCT256; VENDOR: Lattice
U4 = ld1117s12tr:LD1117S12TR; MANUFACTURER_PART_NUMBER: LD1117S12TR; VENDOR: ST Microelectronics
U7 = cirrus-3:CS4344
U8 = ftdichip:FT230X: USB to BASIC UART IC Auto generated by make-symbol-device-package-bsdl.ulp Rev. 43 Source: Data sheet <http://www.ftdichip.com/Support/Documents/DataSheets/ICs/DS_FT230X.pdf>
U9 = misclib2:STM32F407_144_MG: stm32f407_144 edit this description Auto generated by make-symbol-device-package-bsdl.ulp Rev. 43 Source: stm32f407_144.txt Connect-List generated from STM32F407_144.DEV Variant 144 with split-device-symbol.ulp
U10 = misclib3:AT25F512A
U11 = Discrete-new:MICROPHONE-MP34DT01
U12 = analog_devices:ADP7156
U18 = lan8742:LAN8742
X1 X2 = ecs_crystal:ECS-250-20-30B-DU
Z1-Z4 = misc8:SR2.8_TVS